# EAGLE board Main (EAGLE 7.2.0), part 1 of 3
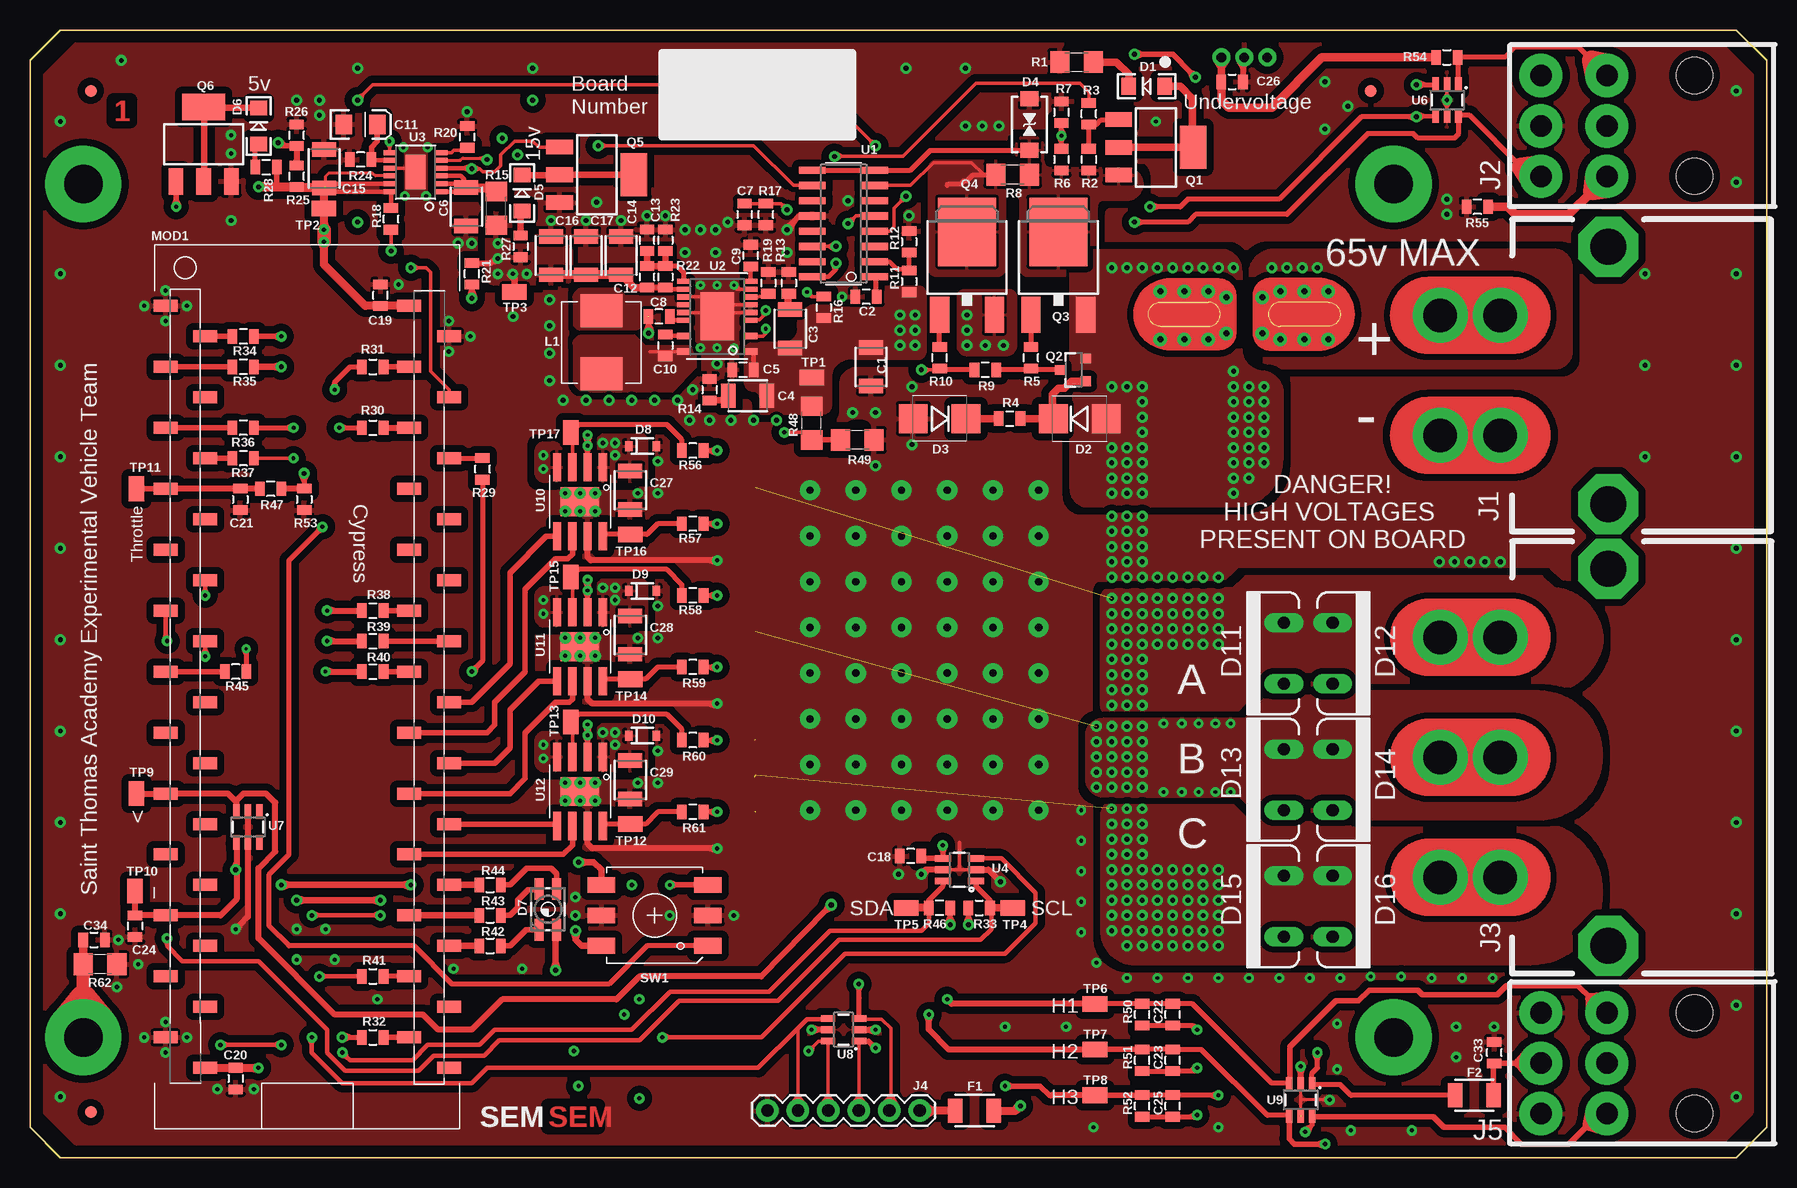
[diagram p6: board, top side]
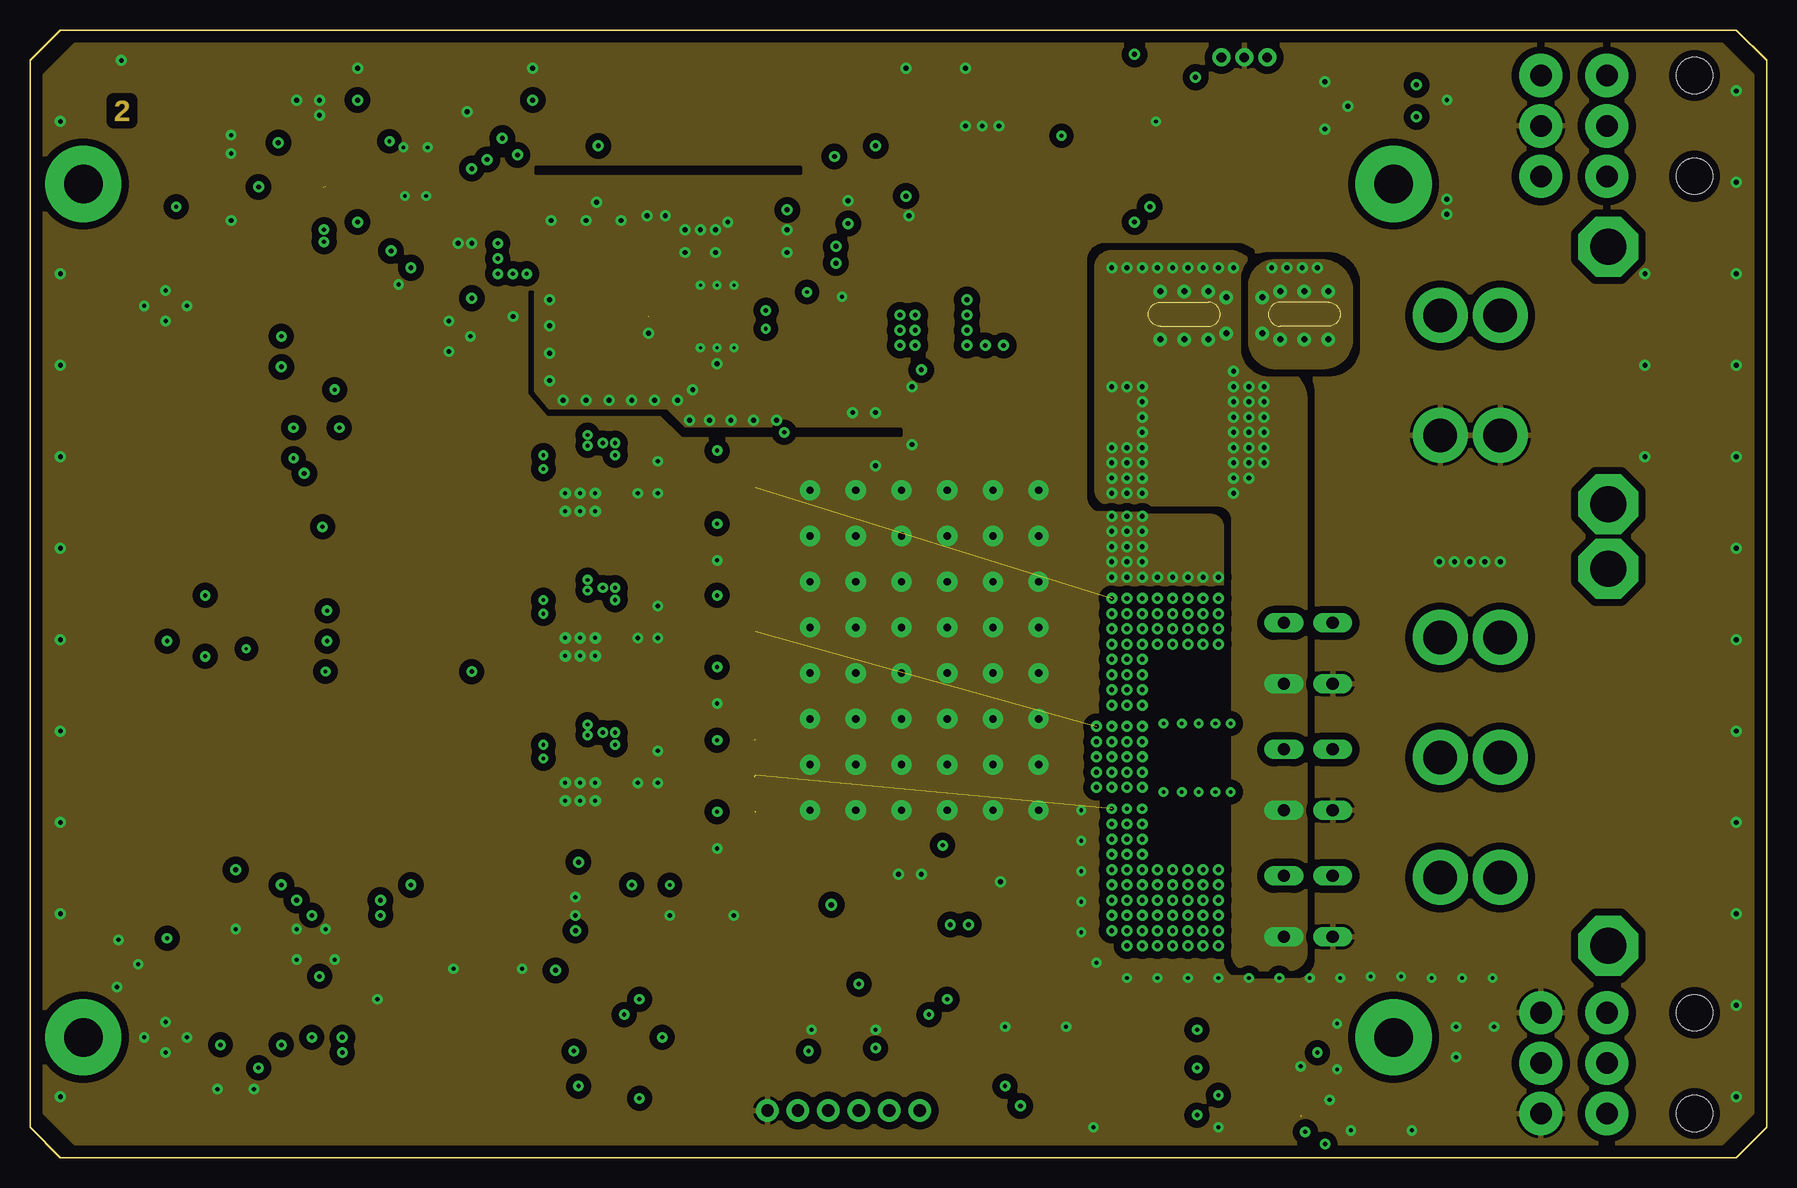
[diagram p7: board, inner layer Route2]
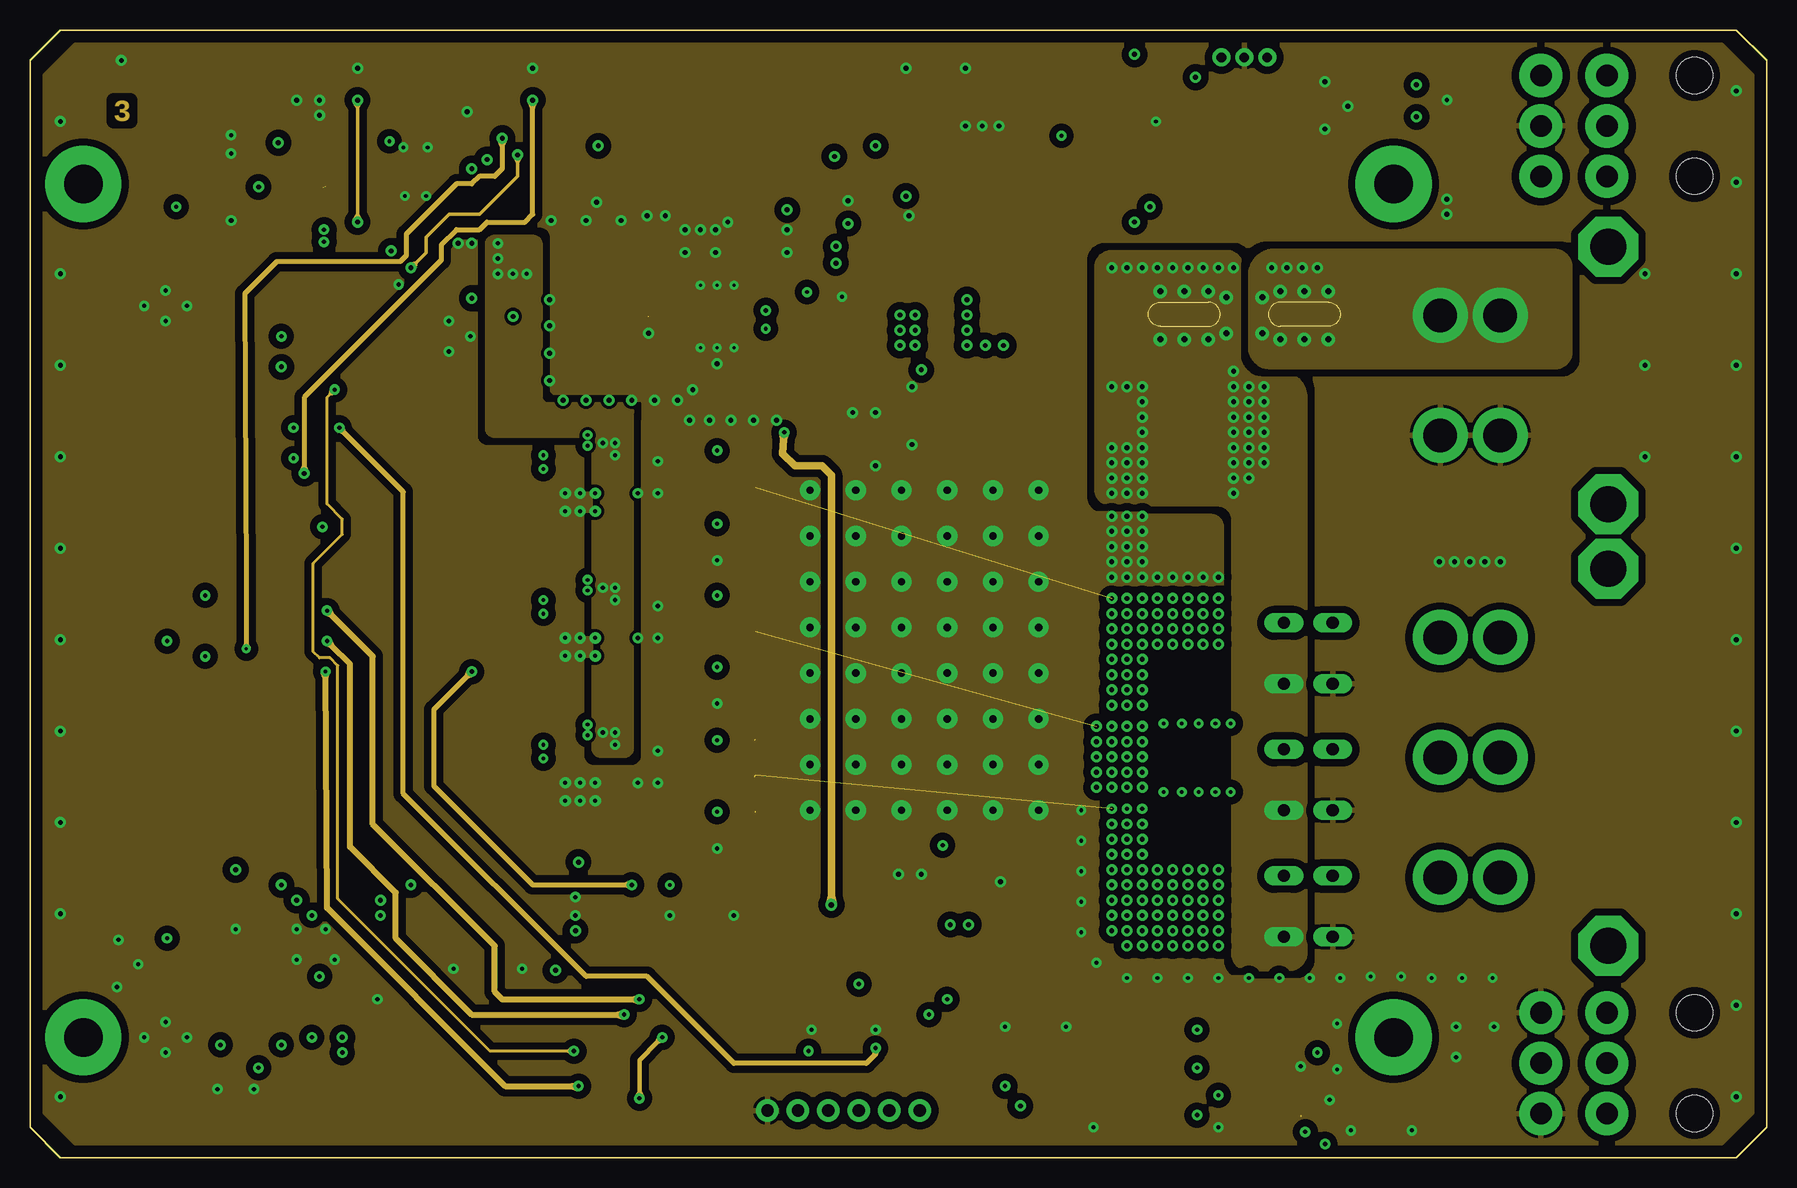
[diagram p8: board, inner layer Route3]
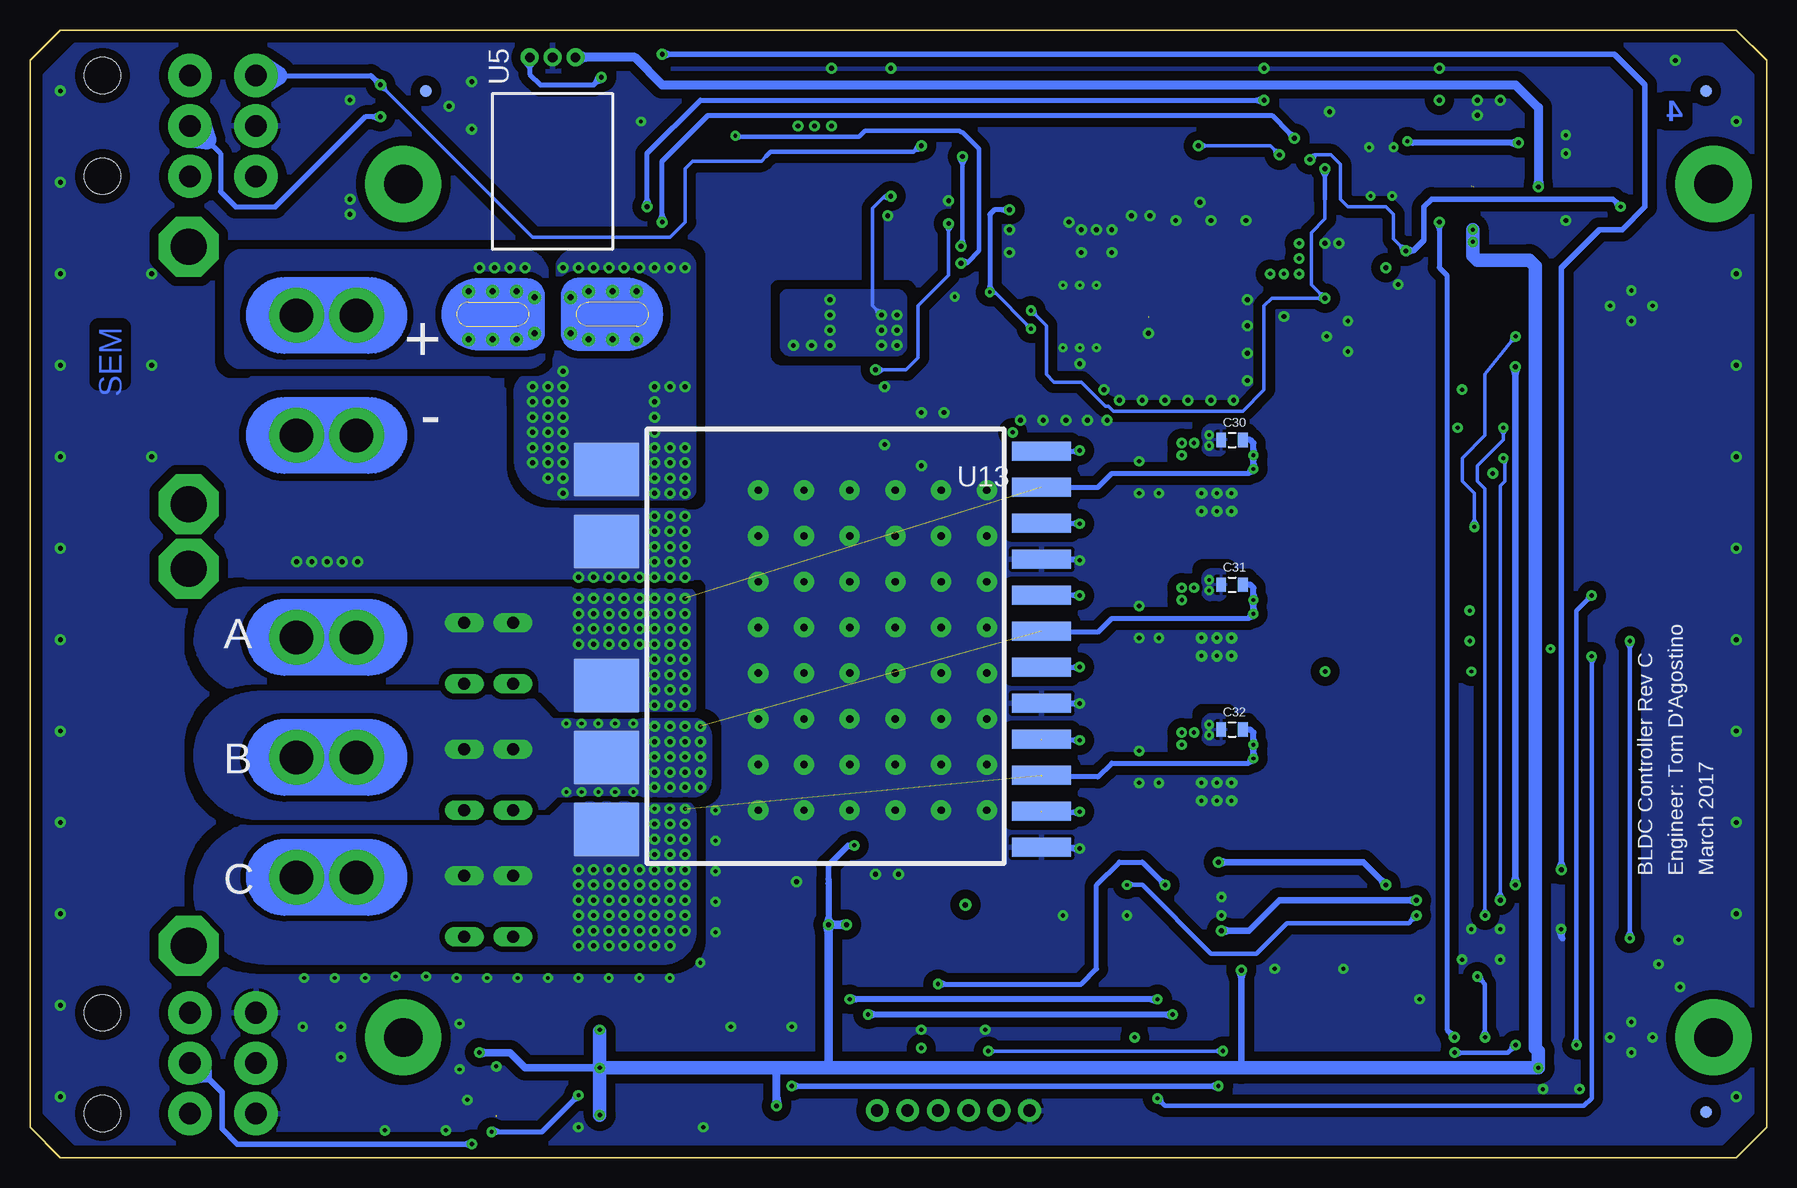
[diagram p9: board, bottom side, seen from below]

Size 144.78 x 93.98 mm. Coordinates in mm from the lower left corner, seen from the top.
Outline: 0,2.54 2.54,0 142.24,0 144.78,2.54 144.78,91.44 142.24,93.98 2.54,93.98 0,91.44 0,2.54
Copper layers (1*2*3*16): Top 0.035559375mm / dielectric 11mil / Route2 0.035559375mm / dielectric 50mil / Route3 0.035559375mm / dielectric 11mil / Bottom 0.035559375mm
Design rules "tvd4layer4pcbstd *": minimum track width 10mil, minimum drill 10mil, track to track 8mil, track to pad 8mil, pad to pad 8mil, via to via 8mil, smd to smd 8mil, copper to edge 10mil, drill to drill 10mil, minimum pad ring 12mil, minimum via ring 10mil, stop-mask expansion 4mil, vias tented up to drill 25mil, thermal gap 10mil

## Footprints (pad centres in the part's own frame; a part is rotated, then mirrored left to right if it is on the bottom)
1210 = smd 1.2 x 2: 1 -1.6,0; 2 1.6,0
0805 = smd 0.8 x 1.2: 1 -0.9,0; 2 0.9,0
EIA3216 = smd 1.4 x 1.6: A 1.4,0; C -1.4,0
LED-1206 = smd 1.2 x 1.4: A -1.5,0; C 1.5,0
SMB-DIODE = smd 2.4 x 2.4: A 2.2,0; C -2.2,0
SMA-DIODE-BI = smd 1.27 x 1.47: A -2.15,0; C 2.15,0
P-LCC-4-3 = smd 0.75 x 1.8: 1 0.725,1.7; 2 -0.725,1.7; 3 -0.725,-1.7; 4 0.725,-1.7
SOD-323 = smd 0.63 x 0.83: A 1.15,0; C -1.15,0
TO220V_2 = drill 1.016 long: 1 -2.54,0; 2 2.54,0
FIDUCIAL-1X2 = smd 1 x 1: 1 0,0
MINIFIT_SR = drill 2.8 pad 4.572: 1_1 0,5; 1_2 0,0; 2_1 10,5; 2_2 10,0 | drill 3 pad 5 octagon: 3 -5.72,-9; 4 15.73,-9
2X03_MINIFIT_JR = drill 1.8 pad 3.6: 1 8.4,0; 2 4.2,0; 3 0,0; 4 0,5.5; 5 4.2,5.5; 6 8.4,5.5 | hole 3: 0,-7.3; 8.4,-7.3
MINIFIT-SRX3 = drill 2.8 pad 4.572: 1_1 0,5; 1_2 0,0; 2_1 10,5; 2_2 10,0; 3_1 20,5; 3_2 20,0 | drill 3 pad 5 octagon: 4 -5.72,-9; 5 25.73,-9
1X06 = drill 1.016 pad 1.88: 1 0,0; 2 2.54,0; 3 5.08,0; 4 7.62,0; 5 10.16,0; 6 12.7,0
IND_SMD_SRP7050TA = smd 2.75 x 3.5: P$1 -2.625,0; P$2 2.625,0
CYKIT059 = smd 2 x 1: 1 -1.65,0; 2 1.65,-2.54; 3 -1.65,-5.08; 4 1.65,-7.62; 5 -1.65,-10.16; 6 1.65,-12.7; 7 -1.65,-15.24; 8 1.65,-17.78; 9 -1.65,-20.32; 10 1.65,-22.86; 11 -1.65,-25.4; 12 1.65,-27.94; 13 -1.65,-30.48; 14 1.65,-33.02; 15 -1.65,-35.56; 16 1.65,-38.1; 17 -1.65,-40.64; 18 1.65,-43.18; 19 -1.65,-45.72; 20 1.65,-48.26; 21 -1.65,-50.8; 22 1.65,-53.34; 23 -1.65,-55.88; 24 1.65,-58.42; 25 -1.65,-60.96; 26 1.65,-63.5; 27 18.67,-60.96; 28 21.97,-63.5; 29 21.97,-58.42; 30 18.67,-55.88; 31 21.97,-53.34; 32 18.67,-50.8; 33 21.97,-48.26; 34 18.67,-45.72; 35 21.97,-43.18; 36 18.67,-40.64; 37 21.97,-38.1; 38 18.67,-35.56; 39 21.97,-33.02; 40 18.67,-30.48; 41 21.97,-27.94; 42 18.67,-25.4; 43 21.97,-22.86; 44 18.67,-20.32; 45 21.97,-17.78; 46 18.67,-15.24; 47 21.97,-12.7; 48 18.67,-10.16; 49 21.97,-7.62; 50 18.67,-5.08; 51 21.97,-2.54; 52 18.67,0
SOT223 = smd 1.219 x 2.235: 1 -2.311,-3.099; 2 0,-3.099; 3 2.311,-3.099 | smd 3.6 x 2.2: 4 0,3.099
SOT23-3 = smd 0.8 x 0.9: 1 -0.95,-1; 2 0.95,-1; 3 0,1.1
DPAK = smd 1.6 x 3: 1 -2.28,-5.31; 3 2.28,-5.31 | smd 4.826 x 5.715: 4 0,1.588
1206 = smd 1.6 x 1.8: 1 -1.4,0; 2 1.4,0
STANDOFF-ELECTRICAL = drill 3.2 pad 6.35: P1 0,0
DIP-8MM = smd 2.286 x 1.321: 1 0,5.08; 2 8.89,0; 4 0,0; 8 8.89,5.08; C1 0,2.54; C2 8.89,2.54
TEST-POINT-MINI = smd 2.05 x 1.3: P$1 0,0
SOIC-16 = smd 0.6 x 2.2: 1 -4.445,-2.6; 2 -3.175,-2.6; 3 -1.905,-2.6; 4 -0.635,-2.6; 5 0.635,-2.6; 6 1.905,-2.6; 7 3.175,-2.6; 8 4.445,-2.6; 9 4.445,2.6; 10 3.175,2.6; 11 1.905,2.6; 12 0.635,2.6; 13 -0.635,2.6; 14 -1.905,2.6; 15 -3.175,2.6; 16 -4.445,2.6
TSSOP-20-FE = smd 0.55 x 1.15: 1 0,0; 3 1.3,0; 18 1.3,5.55; 20 0,5.55 | smd 0.43 x 1.15: 5 2.6,0; 6 3.25,0; 7 3.9,0; 8 4.55,0; 9 5.2,0; 10 5.85,0; 11 5.85,5.55; 12 5.2,5.55; 13 4.55,5.55; 14 3.9,5.55; 15 3.25,5.55; 16 2.6,5.55 | smd 4 x 2.78: EXP 2.929,2.775
MSOP-12-EP = smd 0.42 x 1.08: 1 0,0; 2 0.65,0; 3 1.3,0; 4 1.95,0; 5 2.6,0; 6 3.25,0; 7 3.25,4.28; 8 2.6,4.28; 9 1.95,4.28; 10 1.3,4.28; 11 0.65,4.28; 12 0,4.28 | smd 2.85 x 1.655: EXP 1.625,2.14
SOT23-6 = smd 0.55 x 1.35: 1 -0.95,-1.375; 2 0,-1.375; 3 0.95,-1.375; 4 0.95,1.375; 5 0,1.375; 6 -0.95,1.375
CB5PIN = drill 0.8 pad 1.5: 1 -1.91,0; 2 0,0; 3 1.91,0 | drill 0.5: 4_1 1.5,20; 4_2 3,19.5; 4_3 5,19.5; 4_4 7,19.5; 4_5 7,23.5; 4_6 5,23.5; 4_7 3,23.5; 4_8 1.5,23; 5_1 -1.5,20; 5_2 -3,19.5; 5_3 -5,19.5; 5_4 -7,19.5; 5_5 -7,23.5; 5_6 -5,23.5; 5_7 -3,23.5; 5_8 -1.5,23
SOT23-6' = smd 0.55 x 1.2: 1 0.95,1.3; 2 0,1.3; 3 -0.95,1.3; 4 -0.95,-1.3; 5 0,-1.3; 6 0.95,-1.3
SOIC-8-EP = smd 0.68 x 2.35: 1 0,0; 2 1.27,0; 3 2.54,0; 4 3.81,0; 5 3.81,5.75; 6 2.54,5.75; 7 1.27,5.75; 8 0,5.75 | drill 0.33 pad 0.61: EP1 0.635,2.15; EP2 1.905,2.15; EP3 3.135,2.15; EP4 3.135,3.65; EP5 1.905,3.65; EP6 0.635,3.65 | smd 3.2 x 2.4: EXP 1.905,2.875
ISOPLUS-DIL = smd 5 x 1.6: G1 0.135,0.02; G2 0.135,6.02; G3 0.135,12.02; G4 0.135,18.02; G5 0.135,24.02; G6 0.135,30.02; S1 0.135,3.02; S2 0.135,9.02; S3 0.135,15.02; S4 0.135,21.02; S5 0.135,27.02; S6 0.135,33.02 | smd 5.5 x 4.5: L1 36.385,19.52; L2 36.385,25.52; L3 36.385,31.52; L+ 36.385,1.52; L- 36.385,7.52

## Placement (x,y rotation side)
C1  4.7u  [1210]  70.1,65.91 270 top
C2  47n  [0805]  69.7,71.75 180 top
C3  4.7u  [1210]  63.37,69.09 90 top
C4  2.2u  [1210]  59.82,63.5 180 top
C5  0.1u  [0805]  59.44,65.66 180 top
C6  10u  [1210]  36.37,79.25 270 top
C7  0.01u  [0805]  59.56,78.61 270 top
C8  2.2u  [0805]  52.43,70.1 180 top
C9  5600p  [0805]  60.07,75.18 90 top
C10  0.1u  [0805]  52.96,67.69 270 top
C11  4.7u  [EIA3216]  27.56,86.11 0 top
C12  200p  [0805]  51.44,73.41 90 top
C13  DNP  [0805]  51.44,76.45 90 top
C14  47u  [1210]  49.28,75.18 90 top
C15  10u  [1210]  24.51,82.42 90 top
C16  47u  [1210]  43.43,75.18 90 top
C17  47u  [1210]  46.35,75.18 90 top
C18  0.1u  [0805]  73.41,25.15 180 top
C19  0.1u  [0805]  29.21,71.88 90 top
C20  0.1u  [0805]  17.14,6.6 270 top
C21  0.1u  [0805]  17.53,54.86 270 top
C22  0.01u  [0805]  95.25,11.94 90 top
C23  0.01u  [0805]  95.25,8.13 90 top
C24  0.01u  [0805]  8.76,19.3 270 top
C25  0.01u  [0805]  95.25,4.32 90 top
C26  0.1u  [0805]  100.2,89.66 0 top
C27  4.7u  [1210]  50.04,55.63 270 top
C28  4.7u  [1210]  50.04,43.56 270 top
C29  4.7u  [1210]  50.04,31.5 270 top
C30  0.1u  [0805]  44.58,59.82 0 bottom
C31  0.1u  [0805]  44.58,47.75 0 bottom
C32  0.1u  [0805]  44.58,35.69 0 bottom
C33  0.1u  [0805]  122.05,8.76 90 top
C34  0.01u  [0805]  5.33,18.16 0 top
D1  RED  [LED-1206]  93.09,89.28 180 top
D2  S3BB  [SMB-DIODE]  87.5,61.59 0 top
D3  S3BB  [SMB-DIODE]  75.82,61.59 180 top
D4  SMAJ70CA  [SMA-DIODE-BI]  83.31,86.11 270 top
D5  GREEN  [LED-1206]  41.02,80.39 90 top
D6  GREEN  [LED-1206]  19.05,85.98 90 top
D7  CLV1A-FKB  [P-LCC-4-3]  43.18,20.7 180 top
D8  SZMM3Z18VST1G  [SOD-323]  51.05,59.31 0 top
D9  SZMM3Z18VST1G  [SOD-323]  51.05,47.24 0 top
D10  SZMM3Z18VST1G  [SOD-323]  51.05,35.18 0 top
D11  MBRF10H100  [TO220V_2]  104.52,42.04 90 top
D12  MBRF10H100  [TO220V_2]  108.58,42.04 270 top
D13  MBRF10H100  [TO220V_2]  104.52,31.5 90 top
D14  MBRF10H100  [TO220V_2]  108.58,31.5 270 top
D15  MBRF10H100  [TO220V_2]  104.52,20.95 90 top
D16  MBRF10H100  [TO220V_2]  108.58,20.95 270 top
F1  B59607A120A62  [1210]  78.74,3.94 180 top
F2  B59607A120A62  [1210]  120.4,5.21 180 top
FD1  FIDUCIAL1X2  [FIDUCIAL-1X2]  111.76,88.9 0 bottom
FD2  FIDUCIAL1X2  [FIDUCIAL-1X2]  5.08,88.9 0 bottom
FD3  FIDUCIAL1X2  [FIDUCIAL-1X2]  5.08,3.81 0 bottom
FD4  FIDUCIAL1X2  [FIDUCIAL-1X2]  111.76,88.9 0 top
FD5  FIDUCIAL1X2  [FIDUCIAL-1X2]  5.08,88.9 0 top
FD6  FIDUCIAL1X2  [FIDUCIAL-1X2]  5.08,3.81 0 top
FRAME1  FRAME-LEDGER  [CREATIVE_COMMONS]  0,0 0 top
FRAME2  FRAME-LEDGER  [CREATIVE_COMMONS]  0,0 0 top
FRAME3  FRAME-LEDGER  [CREATIVE_COMMONS]  0,0 0 top
FRAME4  FRAME-LEDGER  [CREATIVE_COMMONS]  0,0 0 top
FRAME5  FRAME-LEDGER  [CREATIVE_COMMONS]  0,0 0 top
FRAME6  FRAME-LEDGER  [CREATIVE_COMMONS]  0,0 0 top
J1  [MINIFIT_SR]  122.56,60.2 90 top
J2  [2X03_MINIFIT_JR]  131.44,81.79 90 top
J3  [MINIFIT-SRX3]  122.56,23.37 90 top
J4  [1X06]  74.17,3.94 180 top
J5  [2X03_MINIFIT_JR]  131.44,3.68 90 top
L1  22u  [IND_SMD_SRP7050TA]  47.62,67.94 90 top
MOD1  PSOC5LP-DEVBRDCY8CKIT-059  [CYKIT059]  12.95,70.99 0 top
Q1  ZXMP10A17GQ  [SOT223]  93.85,84.2 270 top
Q2  MMBT5551LT1G  [SOT23-3]  87,65.66 90 top
Q3  BUK9240-100A.118  [DPAK]  85.72,75.56 0 top
Q4  BUK9240-100A.118  [DPAK]  78.11,75.56 0 top
Q5  NCV8440  [SOT223]  47.24,81.92 270 top
Q6  NCV8440  [SOT223]  14.48,84.45 0 top
R1  2.8k  [1206]  87.25,91.31 0 top
R2  47k  [0805]  88.27,83.19 270 top
R3  100  [0805]  88.27,87 90 top
R4  10k  [0805]  81.66,61.59 0 top
R5  10  [0805]  83.44,66.67 90 top
R6  124k  [0805]  85.98,83.19 270 top
R7  10k  [0805]  85.98,87.12 270 top
R8  0.2  [1206]  81.92,81.92 180 top
R9  1M  [0805]  79.63,65.66 180 top
R10  10  [0805]  75.82,66.67 90 top
R11  274k  [0805]  73.28,73.03 270 top
R12  4.99k  [0805]  73.28,76.33 270 top
R13  10  [0805]  63.25,72.9 270 top
R14  0.5  [0805]  56.64,64.01 270 top
R15  2  [1206]  38.86,79.12 90 top
R16  124k  [0805]  66.17,70.87 270 top
R17  10k  [0805]  61.34,78.61 90 top
R18  47k  [0805]  30.1,78.23 90 top
R19  25.5k  [0805]  61.54,72.9 270 top
R20  499  [0805]  36.45,85.06 90 top
R21  47k  [0805]  36.83,73.66 90 top
R22  1M  [0805]  52.96,73.41 270 top
R23  57.6k  [0805]  52.96,76.45 270 top
R24  49.9k  [0805]  27.56,83.19 180 top
R25  140k  [0805]  22.23,81.79 90 top
R26  10k  [0805]  22.23,85.22 90 top
R27  2.7k  [0805]  40.89,75.95 270 top
R28  1k  [0805]  19.68,82.55 0 top
R29  100  [0805]  37.72,57.4 90 top
R30  100  [0805]  28.57,60.83 0 top
R31  100  [0805]  28.57,65.91 0 top
R32  100  [0805]  28.57,10.03 0 top
R33  4.7k  [0805]  79.12,20.83 0 top
R34  100  [0805]  17.78,68.45 180 top
R35  100  [0805]  17.78,65.91 180 top
R36  100  [0805]  17.78,60.83 180 top
R37  100  [0805]  17.78,58.29 180 top
R38  100  [0805]  28.57,45.59 0 top
R39  100  [0805]  28.57,43.05 0 top
R40  100  [0805]  28.57,40.51 0 top
R41  100  [0805]  28.57,15.11 0 top
R42  1k  [0805]  38.35,17.65 0 top
R43  1k  [0805]  38.35,20.19 0 top
R44  1k  [0805]  38.35,22.73 0 top
R45  100  [0805]  17.14,40.51 180 top
R46  4.7k  [0805]  75.82,20.83 180 top
R47  100  [0805]  20.07,55.75 180 top
R48  100k  [1206]  65.15,61.21 90 top
R49  5.1k  [1206]  68.96,59.82 180 top
R50  10k  [0805]  92.71,11.94 90 top
R51  10k  [0805]  92.71,8.13 90 top
R52  10k  [0805]  92.71,4.32 90 top
R53  510k  [0805]  22.86,54.86 270 top
R54  1k  [0805]  118.11,91.69 0 top
R55  1k  [0805]  120.65,79.25 180 top
R56  10  [0805]  55.24,58.93 180 top
R57  10  [0805]  55.24,52.83 180 top
R58  10  [0805]  55.24,46.86 180 top
R59  10  [0805]  55.24,40.89 180 top
R60  10  [0805]  55.24,34.8 180 top
R61  10  [0805]  55.24,28.83 180 top
R62  1M  [1206]  5.84,16.13 180 top
S1  STANDOFF_ELECTRICAL  [STANDOFF-ELECTRICAL]  4.45,10.03 0 top
S2  STANDOFF_ELECTRICAL  [STANDOFF-ELECTRICAL]  113.67,81.15 0 top
S3  STANDOFF_ELECTRICAL  [STANDOFF-ELECTRICAL]  113.67,10.03 0 top
S4  STANDOFF_ELECTRICAL  [STANDOFF-ELECTRICAL]  4.45,81.15 0 top
SW1  DIP-SWTCH-16POSCD16RM0SBR  [DIP-8MM]  56.52,22.73 180 top
TP1  [TEST-POINT-MINI]  65.15,65.02 0 top
TP2  [TEST-POINT-MINI]  24.51,79.12 180 top
TP3  [TEST-POINT-MINI]  40.39,72.14 0 top
TP4  [TEST-POINT-MINI]  81.92,20.83 0 top
TP5  [TEST-POINT-MINI]  73.03,20.83 0 top
TP6  [TEST-POINT-MINI]  88.77,12.83 0 top
TP7  [TEST-POINT-MINI]  88.77,9.02 0 top
TP8  [TEST-POINT-MINI]  88.77,5.21 0 top
TP9  [TEST-POINT-MINI]  8.89,30.35 90 top
TP10  [TEST-POINT-MINI]  8.76,22.23 90 top
TP11  [TEST-POINT-MINI]  8.89,55.75 90 top
TP12  [TEST-POINT-MINI]  50.04,27.81 0 top
TP13  [TEST-POINT-MINI]  45.09,36.32 90 top
TP14  [TEST-POINT-MINI]  50.04,39.88 0 top
TP15  [TEST-POINT-MINI]  45.09,48.39 90 top
TP16  [TEST-POINT-MINI]  50.04,51.94 0 top
TP17  [TEST-POINT-MINI]  45.09,60.45 90 top
U1  LT4356-2  [SOIC-16]  67.82,77.85 90 top
U2  LT8631  [TSSOP-20-FE]  60.07,67.18 90 top
U3  LT3045  [MSOP-12-EP]  34.29,80.52 90 top
U4  TMP101  [SOT23-6]  77.47,24 90 top
U5  ACS758LCB  [CB5PIN]  101.22,91.69 180 bottom
U6  ESDA6V1SC6Y  [SOT23-6']  118.11,88.14 0 top
U7  ESDA6V1SC6Y  [SOT23-6']  18.16,27.56 0 top
U8  ESDA6V1SC6Y  [SOT23-6']  67.82,10.67 270 top
U9  ESDA6V1SC6Y  [SOT23-6']  105.92,4.83 0 top
U10  UCC27211A-Q1  [SOIC-8-EP]  47.75,57.53 180 top
U11  UCC27211A-Q1  [SOIC-8-EP]  47.75,45.47 180 top
U12  UCC27211A-Q1  [SOIC-8-EP]  47.75,33.4 180 top
U13  MTI85W100GC  [ISOPLUS-DIL]  60.33,58.89 180 bottom

## Tracks (layer width: path | path; a pad name or v marks a point on that pad's centre or on a via)
5V  (via drill 0.36, 0.36 pad 0.41, 0.41)  (1 unrouted)
  Top 0.254: U3.10 28.8,81.82 28.57,82.04 24.89,82.04 24.64,81.79 24.64,80.95 24.86,81.17 | C15.1 24.45,80.89
  Top 0.356: U3.11 24.86,81.17 | C15.1 24.82,80.52 U3.12 30.1,80.43 R18.2 | R46.1 76.72,20.04 | 76.72,20.04 76.72,19.67 76.83,19.56 | 76.72,20.04 76.46,19.56 v76.71,19.43 76.96,19.55 76.72,20.04
  Top 0.406: R28.2 | F2.2 110.11,5.21 109.22,6.1 106.9,6.1 U9.1 106.87,7.05 107.31,7.49 107.31,8.23 | 95.89,7.24 C23.1 | R51.1 95.87,7.23 95.89,7.24 | R52.1 C25.1 96.77,3.42 | 96.77,3.42 97.14,3.42 v97.28,3.56 | v97.28,10.67 96.91,11.04 96.9,11.04 | 95.89,7.24 96.81,7.24 | 96.81,7.24 97.03,7.24 v97.28,7.49 | 107.31,8.23 | 107.31,8.23 v107.31,8.76 | R50.1 C22.1 96.9,11.04 | 107.31,8.23 107.52,8.66 | 107.52,8.66 | v107.31,8.76 107.52,8.66 | 107.31,8.23 107.11,8.66 | 107.11,8.66 | 107.31,8.23 107.52,8.66 | 107.52,8.66 | 107.31,8.23 107.52,8.66 | v107.31,8.76 107.52,8.66 | 107.31,8.23 | 107.11,8.66 | v107.31,8.76 107.11,8.66 | 107.31,8.23 107.52,8.66 | 107.31,8.23 | 107.31,8.23 107.11,8.66 | v107.31,8.76 107.11,8.66 | 107.31,8.23 107.52,8.66 | v107.31,8.76 107.52,8.66 | 107.31,8.23 107.11,8.66 | v107.31,8.76 107.11,8.66 | 96.81,7.24 97.29,7.26 v97.28,7.49 | 96.81,7.24 97.1,7.63 v97.28,7.49 | 96.77,3.42 97.24,3.33 v97.28,3.56 | 96.77,3.42 97.13,3.73 v97.28,3.56 | 96.9,11.04 97.07,10.59 v97.28,10.67 | 96.9,11.04 97.36,10.88 v97.28,10.67
  Top 0.457: TP2.P$1 C15.1 | R28.2 20.57,81.03 20.45,80.9 | v76.71,19.43 76.71,20.04 | 76.71,20.04 | 76.71,20.04 76.71,20.82 R46.1 | v78.23,19.43 78.23,20.04 | 78.23,20.04 | 78.23,20.04 78.23,20.82 R33.1 | C18.1 74.37,24.95 U4.4 76.09,25.5 | 76.09,25.5 76.09,26.01 v76.07,26.04 | 76.71,20.04 76.5,19.52 | 76.71,20.04 76.92,19.52 | 76.92,19.52 | v76.71,19.43 76.92,19.52 | 78.23,20.04 78.02,19.52 | 78.23,20.04 78.44,19.52 | 78.44,19.52 | v78.23,19.43 78.44,19.52 | 76.71,20.04 76.5,19.52 | 76.5,19.52 | 76.71,20.04 | 76.71,20.04 76.5,19.52 | 76.5,19.52 | v76.71,19.43 76.5,19.52 | 76.71,20.04 76.92,19.52 | 76.71,20.04 76.5,19.52 | v76.71,19.43 76.5,19.52 | 76.71,20.04 76.92,19.52 | 76.92,19.52 | v76.71,19.43 76.92,19.52 | 76.71,20.04 76.5,19.52 | v76.71,19.43 76.5,19.52 | 76.71,20.04 76.92,19.52 | v76.71,19.43 76.92,19.52 | 78.23,20.04 78.02,19.52 | 78.02,19.52 | 78.23,20.04 | 78.23,20.04 78.02,19.52 | 78.02,19.52 | v78.23,19.43 78.02,19.52 | 78.23,20.04 78.44,19.52 | 78.23,20.04 78.02,19.52 | v78.23,19.43 78.02,19.52 | 78.23,20.04 78.44,19.52 | 78.44,19.52 | v78.23,19.43 78.44,19.52 | 78.23,20.04 78.02,19.52 | v78.23,19.43 78.02,19.52 | 78.23,20.04 78.44,19.52 | v78.23,19.43 78.44,19.52 | 76.09,25.5 76.26,25.96 v76.07,26.04 | 76.09,25.5 75.89,25.95 v76.07,26.04
  Top 0.508: C20.1 18.52,7.5 | 18.52,7.5 19.04,7.5 v19.05,7.49 | C19.1 MOD1.52 | 18.52,7.5 18.99,7.33 v19.05,7.49 | 18.52,7.5 18.99,7.66 v19.05,7.49
  Top 0.559: 43.78,18.71 D7.2 43.81,18.91 43.81,16.23 | v43.81,15.62 43.81,16.23 | 43.81,16.23 | 43.81,16.23 43.65,15.67 | 43.81,16.23 43.98,15.67 | 43.81,16.23 | 43.81,16.23 43.65,15.67 | 43.65,15.67 | v43.81,15.62 43.65,15.67 | 43.81,16.23 43.98,15.67 | 43.98,15.67 | v43.81,15.62 43.98,15.67 | 43.81,16.23 43.65,15.67 | 43.81,16.23 43.98,15.67 | 43.81,16.23 43.65,15.67 | v43.81,15.62 43.65,15.67 | 43.81,16.23 43.98,15.67 | v43.81,15.62 43.98,15.67
  Top 0.61: C26.1 99.3,90.89 | 99.3,90.89 U5.1 | 99.3,90.89 99.68,91.44 U5.1 | 99.3,90.89 98.94,91.45 U5.1
  Top 0.66: MOD1.52 27.94,70.99 24.51,74.42 24.51,75.79 | v24.51,77.34 24.51,77.88 | 24.51,77.88 C15.1 | MOD1.26 18.52,7.49 | 18.52,7.49 v19.05,7.49 | 24.51,75.79 v24.51,76.33 | F1.1 82.07,3.94 | 82.07,3.94 82.17,3.94 v82.55,4.32 | 18.52,7.49 19.03,7.39 | v19.05,7.49 19.03,7.39 | 18.52,7.49 19.03,7.59 | v19.05,7.49 19.03,7.59 | 18.52,7.49 19.03,7.39 | 18.52,7.49 19.03,7.59 | 18.52,7.49 19.03,7.39 | v19.05,7.49 19.03,7.39 | 18.52,7.49 19.03,7.59 | v19.05,7.49 19.03,7.59 | 24.51,77.88 24.41,77.36 | v24.51,77.34 24.41,77.36 | 24.51,77.88 24.61,77.36 | v24.51,77.34 24.61,77.36 | 24.51,77.88 24.41,77.36 | 24.51,77.88 24.61,77.36 | 24.51,77.88 24.41,77.36 | v24.51,77.34 24.41,77.36 | 24.51,77.88 24.61,77.36 | v24.51,77.34 24.61,77.36 | 24.51,75.79 24.61,76.31 | v24.51,76.33 24.61,76.31 | 24.51,75.79 24.41,76.31 | v24.51,76.33 24.41,76.31 | 24.51,75.79 24.61,76.31 | 24.51,75.79 24.41,76.31 | 24.51,75.79 24.61,76.31 | v24.51,76.33 24.61,76.31 | 24.51,75.79 24.41,76.31 | v24.51,76.33 24.41,76.31 | 82.07,3.94 82.61,4.2 v82.55,4.32 | 82.07,3.94 82.45,4.4 v82.55,4.32
  Top 0.711: R54.1 107.7,91.69 103.5,87.5 99.95,87.5 99.31,88.14 99.31,89.65 C26.1
  Top 0.762: v19.05,80.9 19.66,80.9 | 19.66,80.9 20.45,80.9 22.21,80.9 R25.1 24.45,80.89 | 19.66,80.9 19.06,80.97 | v19.05,80.9 19.06,80.97 | 19.66,80.9 19.06,80.82 | v19.05,80.9 19.06,80.82 | 19.66,80.9 19.06,80.97 | 19.06,80.97 | v19.05,80.9 19.06,80.97 | 19.66,80.9 19.06,80.82 | v19.05,80.9 19.06,80.82 | 19.66,80.9 19.06,80.97 | v19.05,80.9 19.06,80.97 | 19.66,80.9 19.06,80.82 | v19.05,80.9 19.06,80.82
  Top 1.143: v24.51,77.34 v24.51,76.33
  Bottom 0.356: 78.11,19.56 v78.23,19.43
  Bottom 0.406: v97.28,7.49 97.54,7.49 | v97.28,10.67 97.28,10.54
  Bottom 0.457: v76.07,26.04 76.58,26.04 76.61,26.01 | 76.61,26.01 78.23,24.38 78.23,22.86 | 76.61,26.01 76.16,26.22 v76.07,26.04 | 76.61,26.01 76.14,25.84 v76.07,26.04
  Bottom 0.508: 78.23,23.24 78.23,22.86 78.23,20.04 | 78.23,20.04 | 78.23,20.04 v78.23,19.43 | 78.23,20.04 78.04,19.5 | 78.23,20.04 78.42,19.5 | 78.23,20.04 | 78.23,20.04 78.04,19.5 | 78.04,19.5 | v78.23,19.43 78.04,19.5 | 78.23,20.04 78.42,19.5 | 78.42,19.5 | v78.23,19.43 78.42,19.5 | 78.23,20.04 78.04,19.5 | 78.23,20.04 78.42,19.5 | 78.23,20.04 78.04,19.5 | v78.23,19.43 78.04,19.5 | 78.23,20.04 78.42,19.5 | v78.23,19.43 78.42,19.5
  Bottom 0.559: v43.81,15.62 43.81,15.01 | 43.81,15.01 | 43.81,15.01 43.81,7.49 43.81,7.37 | 43.81,15.01 43.98,15.57 | 43.81,15.01 43.65,15.57 | 43.98,15.57 | 43.65,15.57 | 43.81,15.01 43.98,15.57 | 43.81,15.01 | 43.81,15.01 43.65,15.57 | 43.81,15.01 43.98,15.57 | v43.81,15.62 43.98,15.57 | 43.81,15.01 43.65,15.57 | v43.81,15.62 43.65,15.57 | 43.81,15.01 43.98,15.57 | v43.81,15.62 43.98,15.57 | 43.81,15.01 43.65,15.57 | v43.81,15.62 43.65,15.57
  Bottom 0.61: v97.28,7.49 97.81,7.49 | 97.81,7.49 103.5,7.49 104.78,8.76 106.78,8.76 | 106.78,8.76 v107.31,8.76 | 106.78,8.76 107.28,8.64 | v107.31,8.76 107.28,8.64 | 106.78,8.76 107.28,8.89 | v107.31,8.76 107.28,8.89 | 106.78,8.76 107.28,8.64 | 106.78,8.76 107.28,8.89 | 106.78,8.76 107.28,8.64 | v107.31,8.76 107.28,8.64 | 106.78,8.76 107.28,8.89 | v107.31,8.76 107.28,8.89 | 97.81,7.49 97.31,7.62 | v97.28,7.49 97.31,7.62 | 97.81,7.49 97.31,7.37 | v97.28,7.49 97.31,7.37 | 97.81,7.49 97.31,7.62 | 97.81,7.49 97.31,7.37 | 97.81,7.49 97.31,7.62 | v97.28,7.49 97.31,7.62 | 97.81,7.49 97.31,7.37 | v97.28,7.49 97.31,7.37
  Bottom 0.66: v82.55,4.32 82.55,4.93 | 82.55,4.93 82.55,7.49 | 82.55,4.93 82.43,4.34 | v82.55,4.32 82.43,4.34 | 82.55,4.93 82.67,4.34 | v82.55,4.32 82.67,4.34 | 82.55,4.93 82.43,4.34 | 82.55,4.93 82.67,4.34 | 82.55,4.93 82.43,4.34 | v82.55,4.32 82.43,4.34 | 82.55,4.93 82.67,4.34 | v82.55,4.32 82.67,4.34
  Bottom 0.711: v78.23,19.43 77.62,19.43 | 77.62,19.43 77.32,19.43 | 77.32,19.43 v76.71,19.43 | v78.23,19.43 78.23,18.82 | 78.23,18.82 78.23,7.62 78.11,7.49 | 77.32,19.43 76.72,19.53 | v76.71,19.43 76.72,19.53 | 77.32,19.43 76.72,19.33 | v76.71,19.43 76.72,19.33 | 77.32,19.43 76.72,19.53 | 77.32,19.43 76.72,19.33 | 77.32,19.43 76.72,19.53 | v76.71,19.43 76.72,19.53 | 77.32,19.43 76.72,19.33 | v76.71,19.43 76.72,19.33 | 77.62,19.43 78.22,19.33 | v78.23,19.43 78.22,19.33 | 77.62,19.43 78.22,19.53 | v78.23,19.43 78.22,19.53 | 78.23,18.82 78.33,19.41 | v78.23,19.43 78.33,19.41 | 78.23,18.82 78.13,19.41 | v78.23,19.43 78.13,19.41 | 77.62,19.43 78.22,19.33 | 77.62,19.43 78.22,19.53 | 77.62,19.43 78.22,19.33 | v78.23,19.43 78.22,19.33 | 77.62,19.43 78.22,19.53 | v78.23,19.43 78.22,19.53 | 78.23,18.82 78.33,19.41 | 78.23,18.82 78.13,19.41 | 78.23,18.82 78.33,19.41 | v78.23,19.43 78.33,19.41 | 78.23,18.82 78.13,19.41 | v78.23,19.43 78.13,19.41
  Bottom 0.762: 19.05,81.51 19.05,87.5 20.95,89.41 92.08,89.41 94.36,91.69 98.51,91.69 | 19.05,81.51 v19.05,80.9 | 98.51,91.69 U5.1 | 98.51,91.69 | 98.51,91.69 99.14,91.37 | 99.14,91.37 | U5.1 99.14,91.37 | 98.51,91.69 99.14,92.02 | 19.05,81.51 18.97,80.91 | v19.05,80.9 18.97,80.91 | 19.05,81.51 19.13,80.91 | v19.05,80.9 19.13,80.91 | 19.05,81.51 18.97,80.91 | 18.97,80.91 | v19.05,80.9 18.97,80.91 | 19.05,81.51 19.13,80.91 | v19.05,80.9 19.13,80.91 | 19.05,81.51 18.97,80.91 | v19.05,80.9 18.97,80.91 | 19.05,81.51 19.13,80.91 | v19.05,80.9 19.13,80.91 | 98.51,91.69 | 98.51,91.69 | 98.51,91.69 99.14,91.37 | 99.14,91.37 | U5.1 99.14,91.37 | 98.51,91.69 99.14,92.02 | 99.14,92.02 | U5.1 99.14,92.02 | 98.51,91.69 99.14,91.37 | 98.51,91.69 99.14,92.02 | 98.51,91.69 99.14,91.37 | U5.1 99.14,91.37 | 98.51,91.69 99.14,92.02 | U5.1 99.14,92.02
  Bottom 1.143: v24.51,77.34 24.51,75.18 24.13,74.8 19.81,74.8 19.3,74.3 19.3,9.14 19.05,8.89 v19.05,7.49 43.81,7.49 78.11,7.49 82.55,7.49 v97.28,7.49 | v97.28,3.56 v97.28,7.49 | 97.28,10.54 v97.28,7.49
  pour Top (isolate 0.254, rank 3): 28.96,80.52 28.96,81.15 23.62,81.15 23.62,80.52
5V_PG  (via drill 0.36, 0.41)
  Top 0.254: U3.5 35.87,83.12 36.07,83.31 37.5,83.31 | 37.5,83.31 37.97,83.31 v38.1,83.19 | 37.5,83.31 37.87,82.95 v38.1,83.19 | 37.5,83.31 37.98,83.49 v38.1,83.19
  Top 0.305: v30.1,75.56 30.1,76.17 | 30.1,76.17 R18.1 | 30.1,76.17 | 30.1,76.17 29.84,75.72 | 30.1,76.17 30.36,75.72 | 30.36,75.72 | v30.1,75.56 30.36,75.72 | 30.1,76.17 | 30.1,76.17 | 30.1,76.17 29.84,75.72 | 29.84,75.72 | 30.1,76.17 29.84,75.72 | 29.84,75.72 | v30.1,75.56 29.84,75.72 | 30.1,76.17 30.36,75.72 | 30.1,76.17 29.84,75.72 | v30.1,75.56 29.84,75.72 | 30.1,76.17 30.36,75.72 | 30.36,75.72 | v30.1,75.56 30.36,75.72 | 30.1,76.17 29.84,75.72 | v30.1,75.56 29.84,75.72 | 30.1,76.17 30.36,75.72 | v30.1,75.56 30.36,75.72
  Top 0.457: v12.19,79.25 12.19,79.78 | 12.19,79.78 | 12.19,79.78 12.19,81.33 Q6.1 | 12.19,79.78 12,79.33 | 12.19,79.78 12.38,79.33 | 12.38,79.33 | v12.19,79.25 12.38,79.33 | 12.19,79.78 12,79.33 | 12,79.33 | 12.19,79.78 | 12.19,79.78 12,79.33 | 12,79.33 | v12.19,79.25 12,79.33 | 12.19,79.78 12.38,79.33 | 12.19,79.78 12,79.33 | v12.19,79.25 12,79.33 | 12.19,79.78 12.38,79.33 | 12.38,79.33 | v12.19,79.25 12.38,79.33 | 12.19,79.78 12,79.33 | v12.19,79.25 12,79.33 | 12.19,79.78 12.38,79.33 | v12.19,79.25 12.38,79.33
  Bottom 0.305: 30.53,76 31.11,76.58 31.11,78.61 31.75,79.25 34.92,79.25 35.56,79.88 35.56,82.8 36.32,83.57 37.62,83.57 | 30.53,76 v30.1,75.56 | 37.62,83.57 37.72,83.57 v38.1,83.19 | 37.62,83.57 37.82,83.07 v38.1,83.19 | 37.62,83.57 38.15,83.49 v38.1,83.19 | 30.53,76 30.02,75.86 v30.1,75.56 | 30.53,76 30.39,75.49 v30.1,75.56
  Bottom 0.457: v30.1,75.56 29.49,75.56 | 29.49,75.56 | 29.49,75.56 29.46,75.56 28.57,76.45 28.57,79.25 27.94,79.88 12.83,79.88 12.57,79.62 | 12.57,79.62 v12.19,79.25 | 29.49,75.56 30.01,75.35 | 29.49,75.56 30.01,75.78 | 30.01,75.78 | v30.1,75.56 30.01,75.78 | 29.49,75.56 30.01,75.35 | 30.01,75.35 | 29.49,75.56 | 29.49,75.56 30.01,75.35 | 30.01,75.35 | v30.1,75.56 30.01,75.35 | 29.49,75.56 30.01,75.78 | 29.49,75.56 30.01,75.35 | v30.1,75.56 30.01,75.35 | 29.49,75.56 30.01,75.78 | 30.01,75.78 | v30.1,75.56 30.01,75.78 | 29.49,75.56 30.01,75.35 | v30.1,75.56 30.01,75.35 | 29.49,75.56 30.01,75.78 | v30.1,75.56 30.01,75.78 | 12.57,79.62 12.11,79.44 v12.19,79.25 | 12.57,79.62 12.38,79.17 v12.19,79.25
5V_SET_CONNECTION
  Top 0.356: U3.8 28.53,83.12 R24.1
  Top 0.457: R24.1 28.46,84.21 28.96,84.71 C11.A
15V  (via drill 0.36)
  Top 0.356: 53.21,72.38 R22.2 53.08,72.38 U2.12
  Top 0.508: R22.2 C12.1 | R21.2 38.34,74.56 38.52,74.67 | 38.52,74.67 38.73,74.8 | 38.52,74.67 38.86,75.05 | v38.99,74.93 38.86,75.05 | 38.52,74.67 39.02,74.75 v38.99,74.93 | 38.52,74.67 38.86,75.05 | v38.99,74.93 38.86,75.05
  Top 0.559: TP3.P$1 40.39,73.14 | 40.39,73.14 40.39,73.15 40.01,73.53 | 40.39,73.14 40.41,73.65 v40.26,73.66 40.13,73.58 40.39,73.14
  Top 0.61: C12.1 50.35,72.51 C14.1
  Top 0.762: C17.1 C14.1 C16.1
  other vias: 47.75,59.56 48.77,59.56 48.77,58.55 47.75,47.5 48.77,47.5 48.77,46.48 47.75,35.43 48.77,35.43 48.77,34.42 41.4,73.66 38.99,73.66 38.99,76.2
  pour Top (isolate 0.254, rank 3): 38.1,78.61 38.1,73.53 arc90 38.73,72.9 44.45,72.9 arc90 45.09,73.53 45.09,75.44 arc90 44.45,76.07 40.64,76.07 arc-90 40.01,76.71 40.01,78.61 arc90 39.37,78.61 38.73,78.61 arc90
  pour Top (isolate 0.254, rank 3): 47.37,59.94 47.37,56.64 47.62,56.39 51.18,56.39 51.44,56.64 51.44,59.94 51.18,60.2 47.62,60.2
  pour Top (isolate 0.254, rank 3): 47.37,47.88 47.37,44.58 47.62,44.32 51.18,44.32 51.44,44.58 51.44,47.88 51.18,48.13 47.62,48.13
  pour Top (isolate 0.254, rank 3): 47.37,35.81 47.37,32.51 47.62,32.26 51.18,32.26 51.44,32.51 51.44,35.81 51.18,36.07 47.62,36.07
  pour Route3 (isolate 0.254, rank 3): 38.73,76.71 arc90 38.1,76.07 38.1,60.83 arc90 38.73,60.2 46.35,60.2 arc-90 46.99,59.56 46.99,34.16 arc90 47.62,33.53 49.53,33.53 arc90 50.16,34.16 50.16,62.1 arc90 49.53,62.74 43.18,62.74 arc-90 42.55,63.37 42.55,76.07 arc90 41.91,76.71
15V_PG  (via drill 0.36, 0.41)
  Top 0.305: v61.34,70.61 61.34,70.36 61.11,70.13 | 61.11,70.13 60.83,69.85 60.14,69.85 U2.5 | v36.83,82.42 37.44,82.42 | 37.44,82.42 37.47,82.42 37.72,82.17 38.73,82.17 39.24,82.68 39.24,83.57 40.39,84.71 41.91,84.71 42.42,84.2 44.12,84.2 Q5.1 44.12,84.33 | 37.44,82.42 | 37.44,82.42 36.98,82.69 | 36.98,82.69 | 36.98,82.69 | v36.83,82.42 36.98,82.69 | 37.44,82.42 36.98,82.16 | 37.44,82.42 36.98,82.69 | 36.98,82.16 | 37.44,82.42 36.98,82.69 | v36.83,82.42 36.98,82.69 | 37.44,82.42 | 36.98,82.16 | v36.83,82.42 36.98,82.16 | 37.44,82.42 36.98,82.69 | 37.44,82.42 | 37.44,82.42 36.98,82.16 | v36.83,82.42 36.98,82.16 | 37.44,82.42 36.98,82.69 | v36.83,82.42 36.98,82.69 | 37.44,82.42 36.98,82.16 | v36.83,82.42 36.98,82.16 | 61.11,70.13 61.49,70.38 v61.34,70.61 | 61.11,70.13 61.06,70.58 v61.34,70.61
  Top 0.356: U3.4 36.22,82.47 | 36.22,82.47 36.78,82.47 v36.83,82.42 | 36.22,82.47 36.68,82.19 v36.83,82.42 | 36.22,82.47 36.72,82.68 v36.83,82.42
  Top 0.508: R21.1 36.83,72.24 | 36.83,72.24 | 36.83,72.24 v36.83,71.63 | 36.83,72.24 36.64,71.7 | 36.83,72.24 37.02,71.7 | 36.83,72.24 | 36.83,72.24 36.64,71.7 | 36.64,71.7 | v36.83,71.63 36.64,71.7 | 36.83,72.24 37.02,71.7 | 37.02,71.7 | v36.83,71.63 37.02,71.7 | 36.83,72.24 36.64,71.7 | 36.83,72.24 37.02,71.7 | 36.83,72.24 36.64,71.7 | v36.83,71.63 36.64,71.7 | 36.83,72.24 37.02,71.7 | v36.83,71.63 37.02,71.7
  Bottom 0.305: 60.96,70.23 60.07,69.34 60.07,65.28 59.44,64.64 57.15,64.64 55.12,62.61 54.86,62.61 54.48,62.23 43.69,62.23 41.91,64.01 41.91,70.99 41.27,71.63 37.44,71.63 | 60.96,70.23 v61.34,70.61 | v36.83,71.63 37.44,71.63 | 36.83,79.88 36.83,78.23 37.97,77.09 37.97,72.77 37.26,72.06 | 37.26,72.06 v36.83,71.63 | 37.44,71.63 | 37.44,71.63 36.98,71.89 | 36.98,71.89 | 36.98,71.89 | v36.83,71.63 36.98,71.89 | 37.44,71.63 36.98,71.36 | 37.44,71.63 36.98,71.89 | 36.98,71.36 | 37.44,71.63 36.98,71.89 | v36.83,71.63 36.98,71.89 | 37.44,71.63 | 36.98,71.36 | v36.83,71.63 36.98,71.36 | 37.44,71.63 36.98,71.89 | 37.44,71.63 | 37.44,71.63 36.98,71.36 | v36.83,71.63 36.98,71.36 | 37.44,71.63 36.98,71.89 | v36.83,71.63 36.98,71.89 | 37.44,71.63 36.98,71.36 | v36.83,71.63 36.98,71.36 | 37.26,72.06 36.75,71.92 v36.83,71.63 | 37.26,72.06 37.12,71.55 v36.83,71.63 | 60.96,70.23 61.41,70.34 v61.34,70.61 | 60.96,70.23 61.07,70.68 v61.34,70.61
  Bottom 0.356: v36.83,82.42 36.83,81.81 | 36.83,81.81 | 36.83,81.81 36.83,79.88 | 37.08,82.3 | 36.83,81.81 36.58,82.3 | 36.58,82.3 | 36.83,81.81 37.08,82.3 | 37.08,82.3 | 37.08,82.3 | 36.83,81.81 36.58,82.3 | 36.58,82.3 | v36.83,82.42 36.58,82.3 | 37.08,82.3 | v36.83,82.42 37.08,82.3 | 36.58,82.3 | 36.83,81.81 | 36.83,81.81 36.58,82.3 | 36.58,82.3 | 36.83,81.81 37.08,82.3 | 37.08,82.3 | 36.83,81.81 | 36.83,81.81 36.58,82.3 | v36.83,82.42 36.58,82.3 | 36.83,81.81 37.08,82.3 | v36.83,82.42 37.08,82.3 | 36.83,81.81 36.58,82.3 | v36.83,82.42 36.58,82.3
!VIN-FAULT  (via drill 0.41)
  Top 0.305: U1.10 63.63,81.03 60.33,84.33 47.98,84.33 | 47.98,84.33 v47.37,84.33 | v31.75,74.17 32.36,74.17 | 32.36,74.17 33.02,74.17 33.4,73.79 33.4,65.53 34.92,64.01 MOD1.49 | 47.98,84.33 | 47.98,84.33 47.52,84.59 | 47.52,84.59 | 47.52,84.59 | v47.37,84.33 47.52,84.59 | 47.98,84.33 47.52,84.06 | 32.36,74.17 | 32.36,74.17 31.9,74.43 | 31.9,74.43 | 31.9,74.43 | v31.75,74.17 31.9,74.43 | 32.36,74.17 31.9,73.9 | 47.98,84.33 47.52,84.59 | 47.52,84.06 | 47.98,84.33 47.52,84.59 | v47.37,84.33 47.52,84.59 | 47.98,84.33 | 47.52,84.06 | v47.37,84.33 47.52,84.06 | 47.98,84.33 47.52,84.59 | 47.98,84.33 | 47.98,84.33 47.52,84.06 | v47.37,84.33 47.52,84.06 | 47.98,84.33 47.52,84.59 | v47.37,84.33 47.52,84.59 | 47.98,84.33 47.52,84.06 | v47.37,84.33 47.52,84.06 | 32.36,74.17 31.9,74.43 | 31.9,73.9 | 32.36,74.17 31.9,74.43 | v31.75,74.17 31.9,74.43 | 32.36,74.17 | 31.9,73.9 | v31.75,74.17 31.9,73.9 | 32.36,74.17 31.9,74.43 | 32.36,74.17 | 32.36,74.17 31.9,73.9 | v31.75,74.17 31.9,73.9 | 32.36,74.17 31.9,74.43 | v31.75,74.17 31.9,74.43 | 32.36,74.17 31.9,73.9 | v31.75,74.17 31.9,73.9
  Route3 0.305: v40.64,83.57 40.64,82.96 | 40.64,82.96 40.64,81.79 37.47,78.61 34.92,78.61 33.02,76.71 33.02,75.44 32.18,74.6 | 32.18,74.6 v31.75,74.17 | 40.64,82.96 | 40.64,82.96 40.9,83.41 | 40.9,83.41 | v40.64,83.57 40.9,83.41 | 40.64,82.96 40.38,83.41 | 40.64,82.96 40.9,83.41 | 40.9,83.41 | 40.38,83.41 | 40.64,82.96 40.9,83.41 | v40.64,83.57 40.9,83.41 | 40.64,82.96 | 40.38,83.41 | v40.64,83.57 40.38,83.41 | 40.64,82.96 40.9,83.41 | 40.64,82.96 | 40.64,82.96 40.38,83.41 | v40.64,83.57 40.38,83.41 | 40.64,82.96 40.9,83.41 | v40.64,83.57 40.9,83.41 | 40.64,82.96 40.38,83.41 | v40.64,83.57 40.38,83.41 | 32.18,74.6 31.67,74.46 v31.75,74.17 | 32.18,74.6 32.04,74.09 v31.75,74.17
  Bottom 0.305: v47.37,84.33 46.76,84.33 | 46.76,84.33 41.4,84.33 41.07,84 | 41.07,84 v40.64,83.57 | 46.76,84.33 | 46.76,84.33 47.22,84.06 | 46.76,84.33 47.22,84.59 | 47.22,84.59 | v47.37,84.33 47.22,84.59 | 46.76,84.33 | 46.76,84.33 | 46.76,84.33 47.22,84.06 | 47.22,84.06 | 46.76,84.33 47.22,84.06 | 47.22,84.06 | v47.37,84.33 47.22,84.06 | 46.76,84.33 47.22,84.59 | 46.76,84.33 47.22,84.06 | v47.37,84.33 47.22,84.06 | 46.76,84.33 47.22,84.59 | 47.22,84.59 | v47.37,84.33 47.22,84.59 | 46.76,84.33 47.22,84.06 | v47.37,84.33 47.22,84.06 | 46.76,84.33 47.22,84.59 | v47.37,84.33 47.22,84.59 | 41.07,84 40.56,83.86 v40.64,83.57 | 41.07,84 40.93,83.49 v40.64,83.57
A  (via drill 0.3, 0.41)  (1 unrouted)
  Bottom 0.406: U13.S1 55.77,55.87 54.61,57.02 43.18,57.02 43.12,57.08 | 43.12,57.08 v42.8,57.4 | 43.12,57.08 42.99,57.47 v42.8,57.4 | 43.12,57.08 42.73,57.21 v42.8,57.4
  Bottom 0.508: v42.8,57.4 42.8,57.86 | 42.8,57.86 42.8,58.09 | 42.8,58.09 v42.8,58.55 | v42.8,58.55 42.8,59 | 42.8,59 42.8,59.56 43.05,59.82 C30.2 | 42.8,59 42.66,58.6 | v42.8,58.55 42.66,58.6 | 42.8,59 42.94,58.6 | v42.8,58.55 42.94,58.6 | 42.8,58.09 42.94,58.5 | 42.94,58.5 | v42.8,58.55 42.94,58.5 | 42.8,58.09 42.66,58.5 | v42.8,58.55 42.66,58.5 | 42.8,58.09 42.94,58.5 | v42.8,58.55 42.94,58.5 | 42.8,58.09 42.66,58.5 | v42.8,58.55 42.66,58.5 | 42.8,59 42.66,58.6 | 42.66,58.6 | v42.8,58.55 42.66,58.6 | 42.8,59 42.94,58.6 | v42.8,58.55 42.94,58.6 | 42.8,59 42.66,58.6 | v42.8,58.55 42.66,58.6 | 42.8,59 42.94,58.6 | v42.8,58.55 42.94,58.6 | 42.8,57.86 42.66,57.45 | v42.8,57.4 42.66,57.45 | 42.8,57.86 42.94,57.45 | v42.8,57.4 42.94,57.45 | 42.8,57.86 42.66,57.45 | 42.66,57.45 | v42.8,57.4 42.66,57.45 | 42.8,57.86 42.94,57.45 | v42.8,57.4 42.94,57.45 | 42.8,57.86 42.66,57.45 | v42.8,57.4 42.66,57.45 | 42.8,57.86 42.94,57.45 | v42.8,57.4 42.94,57.45
  other vias: 95.25,42.8 96.52,42.8 97.79,42.8 99.06,42.8 91.44,42.8 91.44,41.53 91.44,40.26 91.44,38.99 90.17,38.99 93.98,42.8 90.17,40.26 91.44,37.72 90.17,44.07 96.52,44.07 92.71,44.07 91.44,44.07 90.17,42.8 90.17,41.53 95.25,44.07 99.06,44.07 97.79,44.07 93.98,44.07 92.71,42.8 92.71,41.53 92.71,40.26 92.71,38.99 90.17,37.72 92.71,37.72 95.25,45.34 96.52,45.34 97.79,45.34 99.06,45.34 91.44,45.34 93.98,45.34 90.17,46.61 96.52,46.61 92.71,46.61 91.44,46.61 90.17,45.34 95.25,46.61 99.06,46.61 97.79,46.61 93.98,46.61 92.71,45.34
  pour Top (isolate 0.254, rank 3): 42.16,58.93 42.16,57.02 arc90 42.93,56.39 43.69,56.39 arc90 44.32,57.02 44.32,58.93 arc90 43.43,59.56 42.93,59.56 arc90
  pour Bottom (isolate 0.508, rank 3, no thermals): 109.22,37.08 90.17,37.08 arc-90 89.53,37.72 89.53,46.61 arc-90 90.17,47.24 127,47.24 arc-90 130.81,42.8 arc-90 125.09,38.99 111.12,38.99
  pour Top (isolate 0.508, rank 3, no thermals): 109.22,37.08 90.17,37.08 arc-90 89.53,37.72 89.53,46.61 arc-90 90.17,47.24 100.46,47.24 101.47,48.26 125.86,48.26 127,47.24 arc-90 130.81,42.8 arc-90 125.09,38.99 111.12,38.99
B  (via drill 0.3, 0.3 pad 0.3, 0.41)  (1 unrouted)
  Bottom 0.406: U13.S3 60.4,43.8 55.77,43.8 54.61,44.96 43.18,44.96 43.12,45.02 | 43.12,45.02 v42.8,45.34 | 43.12,45.02 42.99,45.4 v42.8,45.34 | 43.12,45.02 42.73,45.15 v42.8,45.34
  Bottom 0.508: v42.8,45.34 42.8,45.8 | 42.8,45.8 42.8,46.02 | 42.8,46.02 v42.8,46.48 | v42.8,46.48 42.8,46.94 | 42.8,46.94 42.8,47.5 43.05,47.75 C31.2 | 42.8,46.94 42.66,46.53 | v42.8,46.48 42.66,46.53 | 42.8,46.94 42.94,46.53 | v42.8,46.48 42.94,46.53 | 42.8,46.02 42.94,46.43 | 42.94,46.43 | v42.8,46.48 42.94,46.43 | 42.8,46.02 42.66,46.43 | v42.8,46.48 42.66,46.43 | 42.8,46.02 42.94,46.43 | v42.8,46.48 42.94,46.43 | 42.8,46.02 42.66,46.43 | v42.8,46.48 42.66,46.43 | 42.8,46.94 42.66,46.53 | 42.66,46.53 | v42.8,46.48 42.66,46.53 | 42.8,46.94 42.94,46.53 | v42.8,46.48 42.94,46.53 | 42.8,46.94 42.66,46.53 | v42.8,46.48 42.66,46.53 | 42.8,46.94 42.94,46.53 | v42.8,46.48 42.94,46.53 | 42.8,45.8 42.66,45.39 | v42.8,45.34 42.66,45.39 | 42.8,45.8 42.94,45.39 | v42.8,45.34 42.94,45.39 | 42.8,45.8 42.66,45.39 | 42.66,45.39 | v42.8,45.34 42.66,45.39 | 42.8,45.8 42.94,45.39 | v42.8,45.34 42.94,45.39 | 42.8,45.8 42.66,45.39 | v42.8,45.34 42.66,45.39 | 42.8,45.8 42.94,45.39 | v42.8,45.34 42.94,45.39
  other vias: 90.17,35.94 97.41,36.2 94.49,36.2 96.01,36.2 97.41,30.48 92.71,35.94 92.71,34.67 92.71,33.4 92.71,32.13 92.71,30.86 91.44,30.86 91.44,32.13 91.44,33.4 91.44,34.67 91.44,35.94 90.17,34.67 90.17,33.4 90.17,32.13 90.17,30.86 98.81,36.2 98.81,30.48 96.01,30.48 94.49,30.48 88.9,35.94 88.9,34.67 88.9,33.4 88.9,32.13 88.9,30.86 100.08,30.48 100.08,36.2
  pour Top (isolate 0.254, rank 3): 42.16,46.86 42.16,44.96 arc90 42.93,44.32 43.69,44.32 arc90 44.32,44.96 44.32,46.86 arc90 43.43,47.5 42.93,47.5 arc90
  pour Bottom (isolate 0.508, rank 2, no thermals): 101.35,36.32 89.53,36.32 arc90 88.27,35.18 88.27,31.62 arc90 89.53,30.35 100.97,30.35 102.87,28.45 125.73,28.45 arc90 130.81,33.53 arc90 125.73,38.61 103.5,38.61
  pour Top (isolate 0.508, rank 2, no thermals): 101.35,36.32 89.53,36.32 arc90 88.27,35.18 88.27,31.62 arc90 89.53,30.35 100.97,30.35 102.87,28.45 125.73,28.45 arc90 130.81,33.53 arc90 125.73,38.61 103.5,38.61
C  (via drill 0.3, 0.36 pad 0.81, 0.41)  (2 unrouted)
  Bottom 0.406: 60.4,31.74 55.77,31.74 54.61,32.89 43.18,32.89 43.12,32.95 | 43.12,32.95 v42.8,33.27 | 43.12,32.95 42.99,33.34 v42.8,33.27 | 43.12,32.95 42.73,33.08 v42.8,33.27
  Bottom 0.508: v42.8,33.27 42.8,33.73 | 42.8,33.73 42.8,33.96 | 42.8,33.96 v42.8,34.42 | v42.8,34.42 42.8,34.87 | 42.8,34.87 42.8,35.43 43.05,35.69 C32.2 | 42.8,34.87 42.66,34.47 | v42.8,34.42 42.66,34.47 | 42.8,34.87 42.94,34.47 | v42.8,34.42 42.94,34.47 | 42.8,33.96 42.94,34.37 | 42.94,34.37 | v42.8,34.42 42.94,34.37 | 42.8,33.96 42.66,34.37 | v42.8,34.42 42.66,34.37 | 42.8,33.96 42.94,34.37 | v42.8,34.42 42.94,34.37 | 42.8,33.96 42.66,34.37 | v42.8,34.42 42.66,34.37 | 42.8,34.87 42.66,34.47 | 42.66,34.47 | v42.8,34.42 42.66,34.47 | 42.8,34.87 42.94,34.47 | v42.8,34.42 42.94,34.47 | 42.8,34.87 42.66,34.47 | v42.8,34.42 42.66,34.47 | 42.8,34.87 42.94,34.47 | v42.8,34.42 42.94,34.47 | 42.8,33.73 42.66,33.33 | v42.8,33.27 42.66,33.33 | 42.8,33.73 42.94,33.33 | v42.8,33.27 42.94,33.33 | 42.8,33.73 42.66,33.33 | 42.66,33.33 | v42.8,33.27 42.66,33.33 | 42.8,33.73 42.94,33.33 | v42.8,33.27 42.94,33.33 | 42.8,33.73 42.66,33.33 | v42.8,33.27 42.66,33.33 | 42.8,33.73 42.94,33.33 | v42.8,33.27 42.94,33.33
  other vias: 95.25,24 96.52,24 97.79,24 99.06,24 91.44,24 91.44,25.27 91.44,26.54 91.44,27.81 90.17,27.81 93.98,24 90.17,26.54 91.44,29.08 90.17,22.73 96.52,22.73 92.71,22.73 91.44,22.73 90.17,24 90.17,25.27 95.25,22.73 99.06,22.73 97.79,22.73 93.98,22.73 92.71,24 92.71,25.27 92.71,26.54 92.71,27.81 90.17,29.08 92.71,29.08 95.25,18.92 96.52,18.92 97.79,18.92 99.06,18.92 91.44,18.92 93.98,18.92 96.52,17.65 92.71,17.65 91.44,17.65 90.17,18.92 95.25,17.65 99.06,17.65 97.79,17.65 93.98,17.65 92.71,18.92 95.25,21.46 96.52,21.46 97.79,21.46 99.06,21.46 91.44,21.46 93.98,21.46 90.17,20.19 96.52,20.19 92.71,20.19 91.44,20.19 90.17,21.46 95.25,20.19 99.06,20.19 97.79,20.19 93.98,20.19 92.71,21.46
  pour Top (isolate 0.254, rank 3): 42.16,34.8 42.16,32.89 arc90 42.93,32.26 43.69,32.26 arc90 44.32,32.89 44.32,34.8 arc90 43.43,35.43 42.93,35.43 arc90
  pour Bottom (isolate 0.457, rank 3, no thermals): 109.22,29.72 90.81,29.72 arc90 89.53,28.45 89.53,18.92 arc90 92.08,16.38 125.09,16.38 arc90 130.81,22.1 arc90 125.09,27.81 111.12,27.81
  pour Top (isolate 0.508, rank 3, no thermals): 109.22,29.72 90.81,29.72 arc90 89.53,28.45 89.53,18.92 arc90 92.08,16.38 125.09,16.38 arc90 130.81,22.1 arc90 125.09,27.81 111.12,27.81
DISABLE  (via drill 0.25, 0.41)
  Top 0.406: J2.4 125.09,81.79 124.32,82.56 120.02,86.87 119.09,86.87 U6.6 119.06,85.28 118.75,84.96 115.7,84.96 115.32,85.34 111.51,85.34 104.78,78.61 97.16,78.61 96.52,77.98 92.69,77.98 | 92.69,77.98 | 92.69,77.98 v92.08,77.98 | v18.03,42.42 18.03,42.04 | 18.03,42.04 18.03,40.52 R45.1 | 92.69,77.98 92.18,78.21 | 92.69,77.98 92.18,77.75 | 92.18,78.21 | v92.08,77.98 92.18,78.21 | 92.18,77.75 | 92.69,77.98 | 92.69,77.98 92.18,78.21 | 92.69,77.98 | 92.69,77.98 92.18,77.75 | v92.08,77.98 92.18,77.75 | 92.69,77.98 92.18,78.21 | v92.08,77.98 92.18,78.21 | 92.69,77.98 92.18,77.75 | v92.08,77.98 92.18,77.75 | 18.03,42.04 18.19,42.34 | v18.03,42.42 18.19,42.34 | 18.03,42.04 17.88,42.34 | v18.03,42.42 17.88,42.34 | 18.03,42.04 18.19,42.34 | 18.03,42.04 17.88,42.34 | 18.03,42.04 18.19,42.34 | v18.03,42.42 18.19,42.34 | 18.03,42.04 17.88,42.34 | v18.03,42.42 17.88,42.34
  Top 0.813: 124.32,82.56 124.59,81.46 J2.4 125.35,83.05 124.32,82.56
  Top 1.626: 124.32,82.56 125.1,81.28 J2.4 125.81,82.77 124.32,82.56
  Route3 0.406: v39.37,84.96 39.37,84.35 | 39.37,84.35 | 39.37,84.35 39.37,82.42 38.73,81.79 37.47,81.79 36.83,81.15 35.56,81.15 31.37,76.96 31.37,75.18 30.86,74.68 20.57,74.68 17.91,72.01 18.03,48.01 18.03,42.8 | 18.03,42.8 v18.03,42.42 | 39.37,84.35 39.6,84.86 | 39.37,84.35 39.14,84.86 | 39.6,84.86 | v39.37,84.96 39.6,84.86 | 39.14,84.86 | 39.37,84.35 | 39.37,84.35 39.6,84.86 | 39.37,84.35 | 39.37,84.35 39.14,84.86 | v39.37,84.96 39.14,84.86 | 39.37,84.35 39.6,84.86 | v39.37,84.96 39.6,84.86 | 39.37,84.35 39.14,84.86 | v39.37,84.96 39.14,84.86 | 18.03,42.8 | 18.03,42.8 17.88,42.5 | v18.03,42.42 17.88,42.5 | 18.03,42.8 | 18.03,42.8 18.19,42.5 | v18.03,42.42 18.19,42.5 | 18.03,42.8 17.88,42.5 | 18.03,42.8 18.19,42.5 | 18.03,42.8 17.88,42.5 | v18.03,42.42 17.88,42.5 | 18.03,42.8 18.19,42.5 | v18.03,42.42 18.19,42.5
  Bottom 0.406: v92.08,77.98 92.08,78.59 | 92.08,78.59 92.08,83.06 88.27,86.87 41.27,86.87 39.8,85.39 | 39.8,85.39 v39.37,84.96 | 92.08,78.59 | 92.08,78.59 91.84,78.08 | 92.08,78.59 92.31,78.08 | 92.31,78.08 | v92.08,77.98 92.31,78.08 | 92.08,78.59 | 92.08,78.59 | 92.08,78.59 91.84,78.08 | 91.84,78.08 | v92.08,77.98 91.84,78.08 | 92.08,78.59 92.31,78.08 | 92.08,78.59 91.84,78.08 | 92.08,78.59 92.31,78.08 | 92.08,78.59 91.84,78.08 | v92.08,77.98 91.84,78.08 | 92.08,78.59 92.31,78.08 | v92.08,77.98 92.31,78.08 | 39.8,85.39 39.28,85.2 v39.37,84.96 | 39.8,85.39 39.61,84.88 v39.37,84.96
DISP_OUT  (via drill 0.36)
  Top 0.305: 66.52,3.84 66.52,4.95 U8.6 65.72,9.72 65.27,9.27 | 65.27,9.27 v64.9,8.89 | 65.27,9.27 64.83,9.16 v64.9,8.89 | 65.27,9.27 65.17,8.82 v64.9,8.89
  Top 0.406: v25.4,64.01 25.4,64.54 | 25.4,64.54 25.4,64.64 26.67,65.91 R31.1 | 25.4,64.54 | 25.4,64.54 25.19,64.11 | 25.4,64.54 25.61,64.11 | 25.61,64.11 | v25.4,64.01 25.61,64.11 | 25.4,64.54 | 25.4,64.54 25.19,64.11 | 25.19,64.11 | 25.4,64.54 | 25.4,64.54 25.19,64.11 | 25.19,64.11 | v25.4,64.01 25.19,64.11 | 25.4,64.54 25.61,64.11 | 25.4,64.54 25.19,64.11 | v25.4,64.01 25.19,64.11 | 25.4,64.54 25.61,64.11 | 25.61,64.11 | v25.4,64.01 25.61,64.11 | 25.4,64.54 25.19,64.11 | v25.4,64.01 25.19,64.11 | 25.4,64.54 25.61,64.11 | v25.4,64.01 25.61,64.11
  Top 0.61: 66.52,4.95 66.04,4.32 J4.4 67.03,4.35 66.52,4.95
  Route3 0.254: v45.34,8.89 44.81,8.89 | 44.81,8.89 | 44.81,8.89 38.35,8.89 25.65,21.59 25.65,41.02 25.02,41.66 24.13,41.66 23.62,42.16 23.62,49.53 26.04,51.94 26.04,53.21 24.77,54.48 24.77,63.37 25.02,63.63 | 25.02,63.63 v25.4,64.01 | 44.81,8.89 | 44.81,8.89 45.16,8.64 | 45.16,8.64 | 44.81,8.89 45.16,8.64 | v45.34,8.89 45.16,8.64 | 44.81,8.89 45.16,9.14 | 45.16,9.14 | v45.34,8.89 45.16,9.14 | 44.81,8.89 45.16,8.64 | 45.16,8.64 | 45.16,8.64 | v45.34,8.89 45.16,8.64 | 44.81,8.89 45.16,9.14 | v45.34,8.89 45.16,9.14 | 44.81,8.89 45.16,8.64 | v45.34,8.89 45.16,8.64 | 44.81,8.89 45.16,9.14 | 45.16,9.14 | v45.34,8.89 45.16,9.14 | 44.81,8.89 45.16,8.64 | v45.34,8.89 45.16,8.64 | 44.81,8.89 45.16,9.14 | v45.34,8.89 45.16,9.14 | 25.02,63.63 25.45,63.71 v25.4,64.01 | 25.02,63.63 25.1,64.06 v25.4,64.01
  Bottom 0.305: v64.9,8.89 64.36,8.89 | 64.36,8.89 | 64.36,8.89 45.87,8.89 | 45.87,8.89 | 45.87,8.89 v45.34,8.89 | 64.75,8.65 | 45.48,8.65 | 64.36,8.89 | 64.36,8.89 64.75,8.65 | 64.36,8.89 64.75,9.13 | 64.36,8.89 64.75,8.65 | v64.9,8.89 64.75,8.65 | 64.36,8.89 64.75,9.13 | 64.75,9.13 | v64.9,8.89 64.75,9.13 | 64.36,8.89 64.75,8.65 | 64.75,8.65 | 64.75,8.65 | v64.9,8.89 64.75,8.65 | 64.36,8.89 64.75,9.13 | v64.9,8.89 64.75,9.13 | 64.36,8.89 64.75,8.65 | v64.9,8.89 64.75,8.65 | 64.36,8.89 64.75,9.13 | 64.75,9.13 | v64.9,8.89 64.75,9.13 | 64.36,8.89 64.75,8.65 | v64.9,8.89 64.75,8.65 | 64.36,8.89 64.75,9.13 | v64.9,8.89 64.75,9.13 | 45.87,8.89 45.48,9.13 | 45.87,8.89 45.48,8.65 | 45.87,8.89 45.48,9.13 | 45.48,9.13 | v45.34,8.89 45.48,9.13 | 45.87,8.89 45.48,8.65 | v45.34,8.89 45.48,8.65 | 45.48,8.65 | 45.87,8.89 45.48,9.13 | v45.34,8.89 45.48,9.13 | 45.87,8.89 45.48,8.65 | 45.48,8.65 | v45.34,8.89 45.48,8.65 | 45.87,8.89 45.48,9.13 | v45.34,8.89 45.48,9.13 | 45.87,8.89 | 45.87,8.89 45.48,8.65 | v45.34,8.89 45.48,8.65 | 45.87,8.89 45.48,9.13 | v45.34,8.89 45.48,9.13 | 45.87,8.89 45.48,8.65 | v45.34,8.89 45.48,8.65
FB
  Top 0.356: R12.2 R11.1 73.16,74.04 72.26,74.04 71.63,74.68 U1.2
GATEDRV  (via drill 0.41)
  Top 0.305: 75.82,65.66 R10.1 75.7,65.66 74.91,65.66 | U1.5 68.83,78.49 68.63,78.28 | 68.63,78.28 v68.2,77.85 | v74.3,65.66 74.91,65.66 | 74.91,65.66 | 74.91,65.66 74.45,65.92 | 74.45,65.92 | 74.45,65.92 | v74.3,65.66 74.45,65.92 | 74.91,65.66 74.45,65.39 | 68.63,78.28 68.12,78.14 v68.2,77.85 | 68.63,78.28 68.49,77.77 v68.2,77.85 | 74.91,65.66 74.45,65.92 | 74.45,65.39 | 74.91,65.66 74.45,65.92 | v74.3,65.66 74.45,65.92 | 74.91,65.66 | 74.45,65.39 | v74.3,65.66 74.45,65.39 | 74.91,65.66 74.45,65.92 | 74.91,65.66 | 74.91,65.66 74.45,65.39 | v74.3,65.66 74.45,65.39 | 74.91,65.66 74.45,65.92 | v74.3,65.66 74.45,65.92 | 74.91,65.66 74.45,65.39 | v74.3,65.66 74.45,65.39
  Top 0.406: R9.2 75.94,65.66 R10.1
  Bottom 0.305: v68.2,77.85 68.2,77.24 | 68.2,77.24 68.2,73.53 70.74,70.99 70.74,66.67 71.75,65.66 73.69,65.66 | 73.69,65.66 v74.3,65.66 | 68.2,77.24 | 68.2,77.24 68.46,77.7 | 68.46,77.7 | v68.2,77.85 68.46,77.7 | 68.2,77.24 67.94,77.7 | 73.69,65.66 | 73.69,65.66 74.14,65.39 | 73.69,65.66 74.14,65.92 | 74.14,65.92 | v74.3,65.66 74.14,65.92 | 68.2,77.24 68.46,77.7 | 68.46,77.7 | 67.94,77.7 | 68.2,77.24 68.46,77.7 | v68.2,77.85 68.46,77.7 | 68.2,77.24 | 67.94,77.7 | v68.2,77.85 67.94,77.7 | 68.2,77.24 68.46,77.7 | 68.2,77.24 | 68.2,77.24 67.94,77.7 | v68.2,77.85 67.94,77.7 | 68.2,77.24 68.46,77.7 | v68.2,77.85 68.46,77.7 | 68.2,77.24 67.94,77.7 | v68.2,77.85 67.94,77.7 | 73.69,65.66 | 73.69,65.66 | 73.69,65.66 74.14,65.39 | 74.14,65.39 | 73.69,65.66 74.14,65.39 | 74.14,65.39 | v74.3,65.66 74.14,65.39 | 73.69,65.66 74.14,65.92 | 73.69,65.66 74.14,65.39 | v74.3,65.66 74.14,65.39 | 73.69,65.66 74.14,65.92 | 74.14,65.92 | v74.3,65.66 74.14,65.92 | 73.69,65.66 74.14,65.39 | v74.3,65.66 74.14,65.39 | 73.69,65.66 74.14,65.92 | v74.3,65.66 74.14,65.92
GH_A
  Top 0.305: U10.3 45.21,60.33 TP17.P$1
  Top 0.406: R56.2 54.34,59.83 53.09,61.09 45.72,61.09 TP17.P$1
GH_B
  Top 0.305: U11.3 45.21,48.26 TP15.P$1
  Top 0.406: R58.2 54.34,47.76 53.09,49.02 45.72,49.02 TP15.P$1
GH_C
  Top 0.305: U12.3 45.21,36.2 TP13.P$1
  Top 0.406: R60.2 54.34,35.7 53.09,36.96 45.72,36.96 TP13.P$1
GL_A
  Top 0.406: R57.2 52.32,52.83 51.44,51.94 TP16.P$1 47.79,51.94 U10.8
GL_B
  Top 0.406: R59.2 52.32,40.89 51.31,39.88 TP14.P$1 47.79,39.88 U11.8
GL_C
  Top 0.406: R61.2 52.32,28.83 51.31,27.81 TP12.P$1 47.79,27.81 U12.8
GND  (via drill 0.25 pad 0.2, 0.3, 0.3 pad 0.25, 0.36, 0.36 pad 0.41, 0.41, 0.41 pad 0.41, 0.61 pad 1.68)  (2 unrouted)
  Top 0.254: 105.92,3.43 105.92,4.83 | 105.92,4.83 105.92,6.35 | v108.33,4.83 107.8,4.83 | 107.8,4.83 | 107.8,4.83 105.92,4.83 | 107.8,4.83 | 107.8,4.83 108.16,4.58 | 108.16,4.58 | 107.8,4.83 108.16,4.58 | v108.33,4.83 108.16,4.58 | 107.8,4.83 108.16,5.08 | 108.16,5.08 | v108.33,4.83 108.16,5.08 | 107.8,4.83 108.16,4.58 | 108.16,4.58 | 108.16,4.58 | v108.33,4.83 108.16,4.58 | 107.8,4.83 108.16,5.08 | v108.33,4.83 108.16,5.08 | 107.8,4.83 108.16,4.58 | v108.33,4.83 108.16,4.58 | 107.8,4.83 108.16,5.08 | 108.16,5.08 | v108.33,4.83 108.16,5.08 | 107.8,4.83 108.16,4.58 | v108.33,4.83 108.16,4.58 | 107.8,4.83 108.16,5.08 | v108.33,4.83 108.16,5.08
  Top 0.305: U2.15 56.98,70.43 U2.EXP | U2.13 56.54,71.73 57.15,71.12 57.15,70.26 U2.EXP | U2.9 58.94,72.38 58.92,72.4 | 58.92,72.4 | 58.92,72.4 v58.67,72.69 | U2.7 58.27,71.08 U2.EXP | U2.6 57.62,70.43 U2.EXP | U6.5 118.11,87.61 | 118.11,87.61 | 118.11,87.61 v118.11,88.14 | v118.11,88.14 118.11,88.67 | 118.11,88.67 | 118.11,88.67 U6.2 | U3.9 31.82,82.47 U3.EXP | 76.2,24 77.47,24 | 77.47,24 78.99,24 | 77.47,24 77.47,26.29 | 58.92,72.4 58.9,72.71 | 58.9,72.71 | 58.92,72.4 | 58.92,72.4 58.62,72.47 | 58.62,72.47 | 58.92,72.4 | 58.92,72.4 58.62,72.47 | 58.62,72.47 | 117.87,87.99 | 117.87,88.28 | v58.67,72.69 59.04,72.51 | 58.92,72.4 58.9,72.71 | 58.9,72.71 | v58.67,72.69 58.9,72.71 | 58.92,72.4 58.62,72.47 | v58.67,72.69 58.62,72.47 | 58.92,72.4 58.9,72.71 | v58.67,72.69 58.9,72.71 | 58.92,72.4 58.62,72.47 | v58.67,72.69 58.62,72.47 | 118.11,87.61 118.35,87.99 | 118.11,87.61 117.87,87.99 | 118.11,88.67 | 118.11,88.67 117.87,88.28 | 118.11,88.67 118.35,88.28 | 118.11,87.61 118.35,87.99 | 118.35,87.99 | v118.11,88.14 118.35,87.99 | 118.11,87.61 117.87,87.99 | v118.11,88.14 117.87,87.99 | 117.87,87.99 | 118.11,88.67 117.87,88.28 | v118.11,88.14 117.87,88.28 | 118.11,88.67 118.35,88.28 | 118.35,88.28 | v118.11,88.14 118.35,88.28 | 118.11,87.61 118.35,87.99 | v118.11,88.14 118.35,87.99 | 118.11,87.61 117.87,87.99 | 117.87,87.99 | v118.11,88.14 117.87,87.99 | 118.11,87.61 118.35,87.99 | v118.11,88.14 118.35,87.99 | 118.11,87.61 | 118.11,87.61 117.87,87.99 | v118.11,88.14 117.87,87.99 | 118.11,87.61 118.35,87.99 | v118.11,88.14 118.35,87.99 | 118.11,87.61 117.87,87.99 | v118.11,88.14 117.87,87.99 | 118.11,88.67 117.87,88.28 | 117.87,88.28 | 117.87,88.28 | v118.11,88.14 117.87,88.28 | 118.11,88.67 118.35,88.28
  Top 0.305: v118.11,88.14 118.35,88.28 | 118.11,88.67 117.87,88.28 | v118.11,88.14 117.87,88.28 | 118.11,88.67 118.35,88.28 | 118.35,88.28 | v118.11,88.14 118.35,88.28 | 118.11,88.67 117.87,88.28 | v118.11,88.14 117.87,88.28 | 118.11,88.67 118.35,88.28 | v118.11,88.14 118.35,88.28